# EasyEDA Pro project raspberry_esp.eprj

# Schematic schematic

## Sheets
1 interface_p0: Board Name: Board1; Create Date: 2025-11-21; Page Name: interface_p0; Project Name: raspberry_esp; Schematic Name: schematic; Update Date: 2025-12-31; Company: 嘉立创EDA; Page Size: A4; Version: V1.0
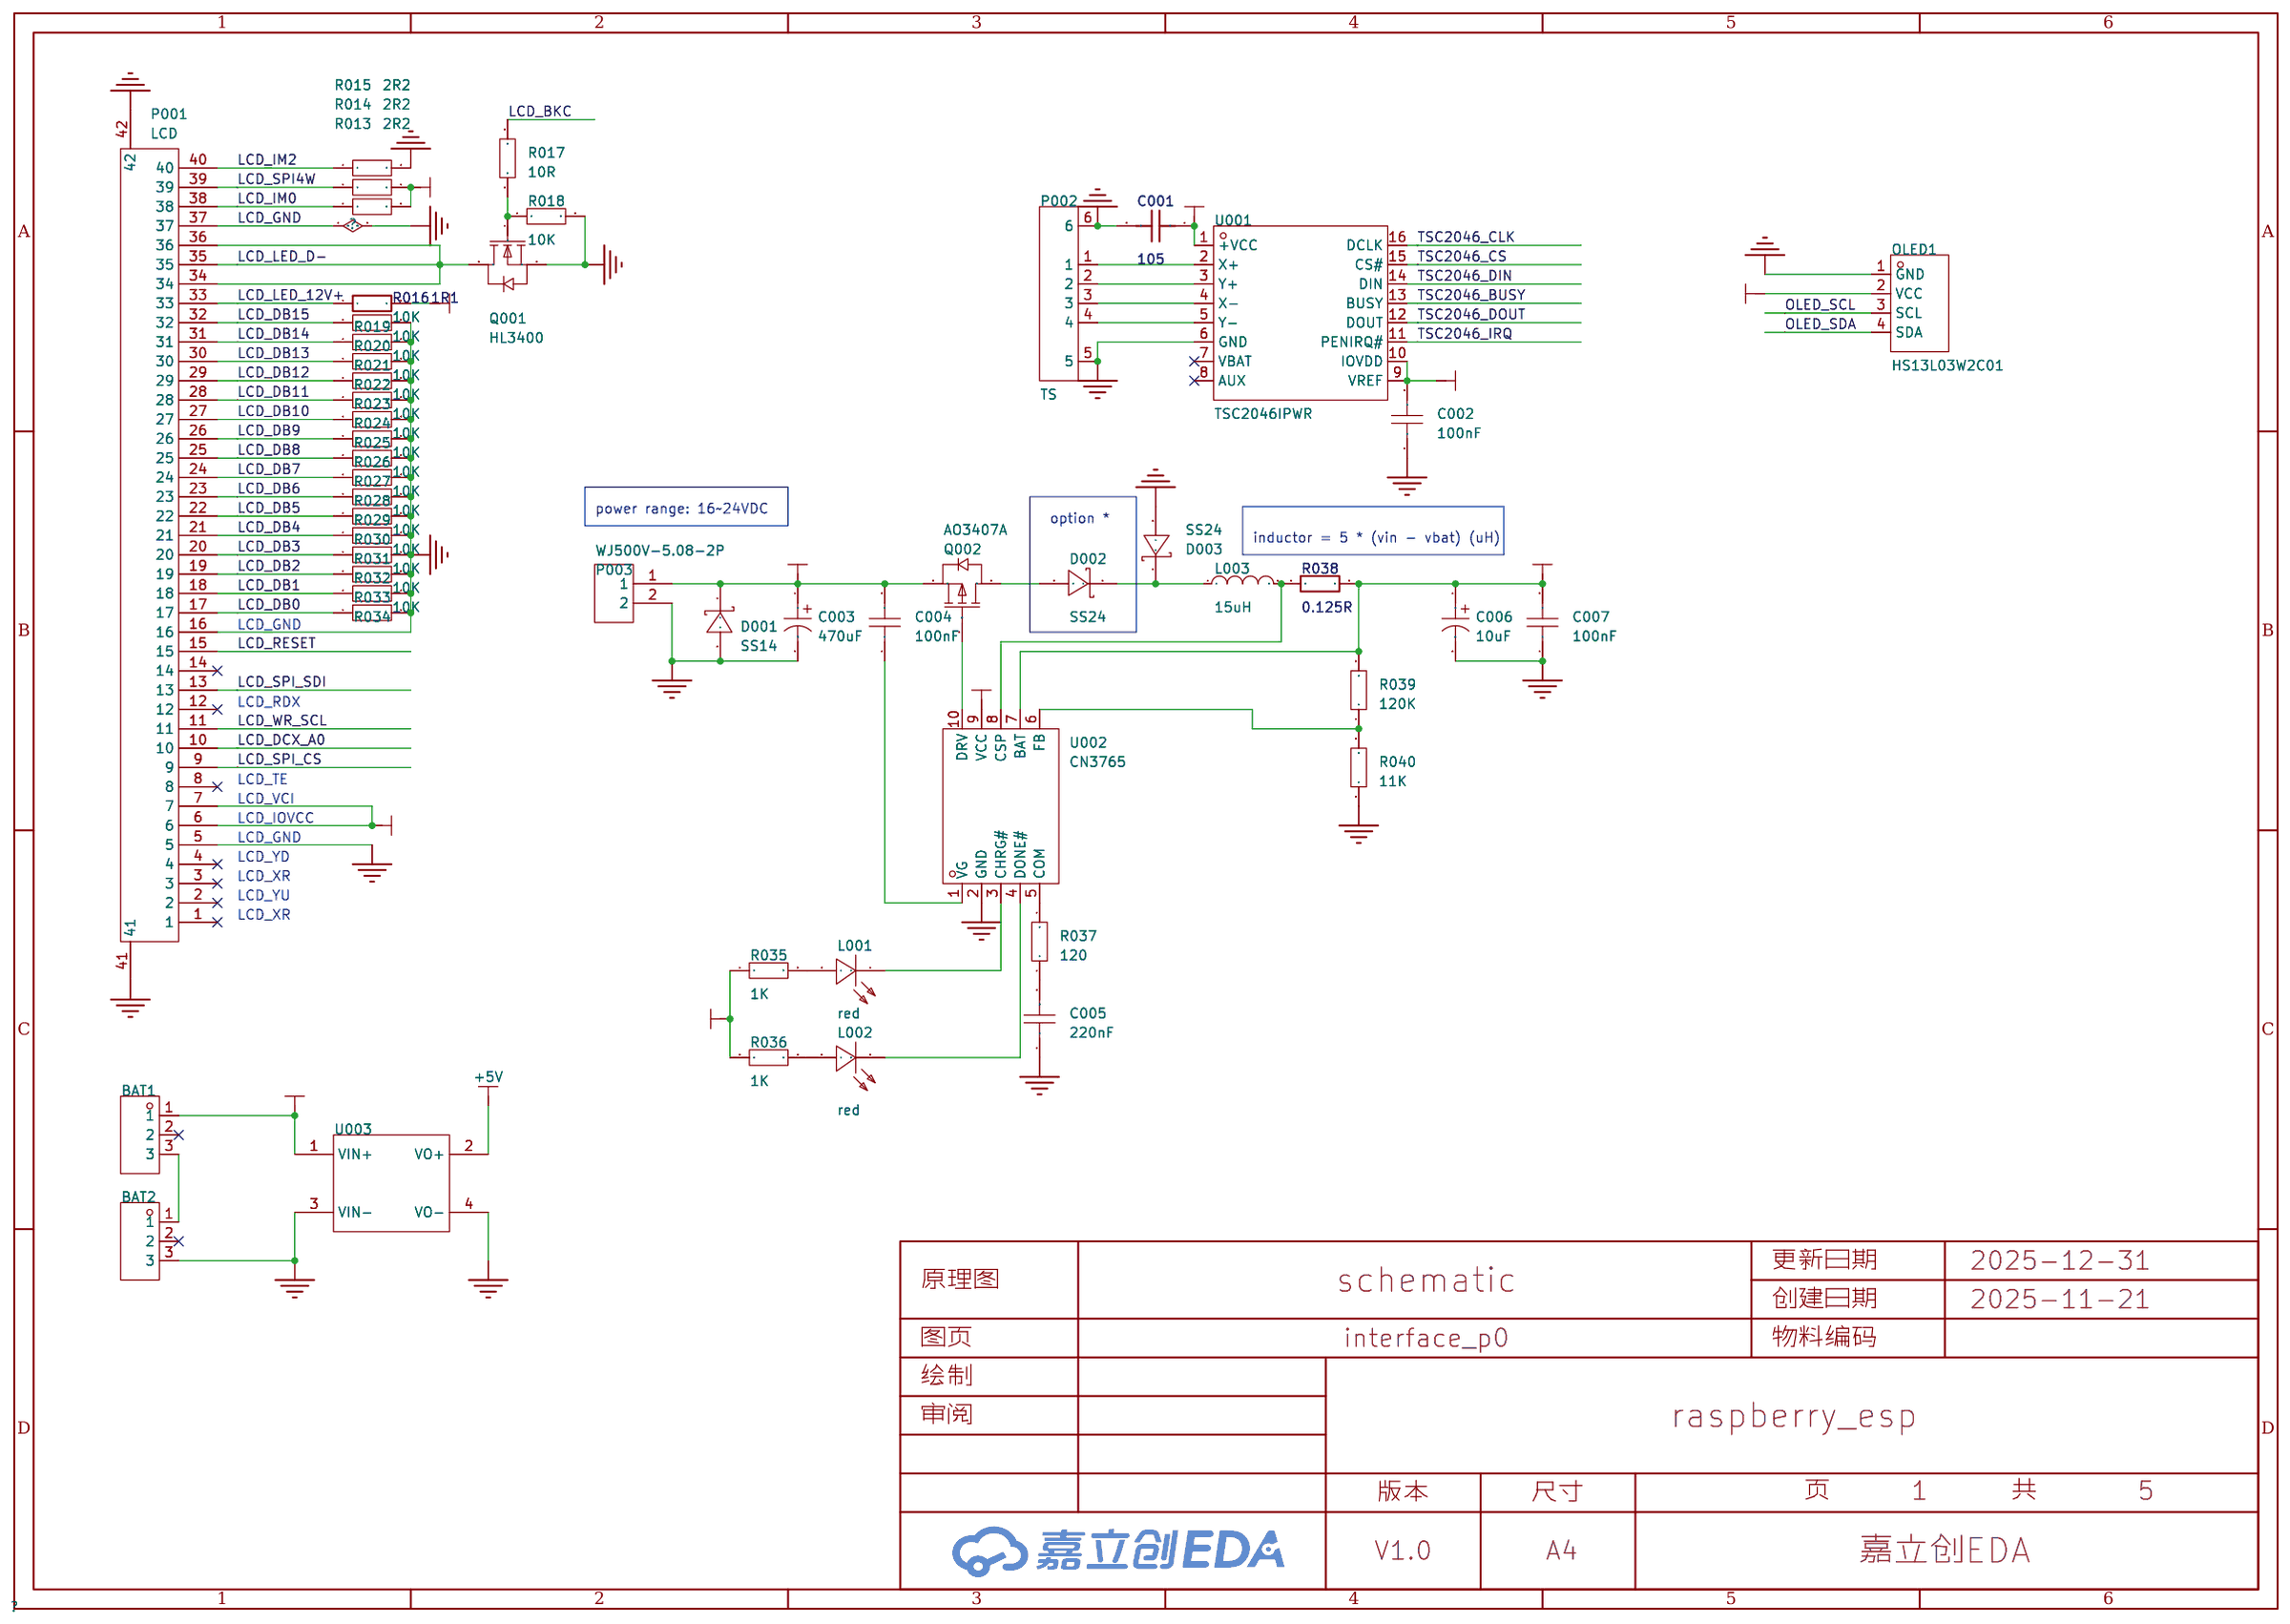
[diagram p0: interface_p0]
2 raspberry_p1: Create Date: 2025-12-24; Page Name: raspberry_p1; Update Date: 2026-01-07
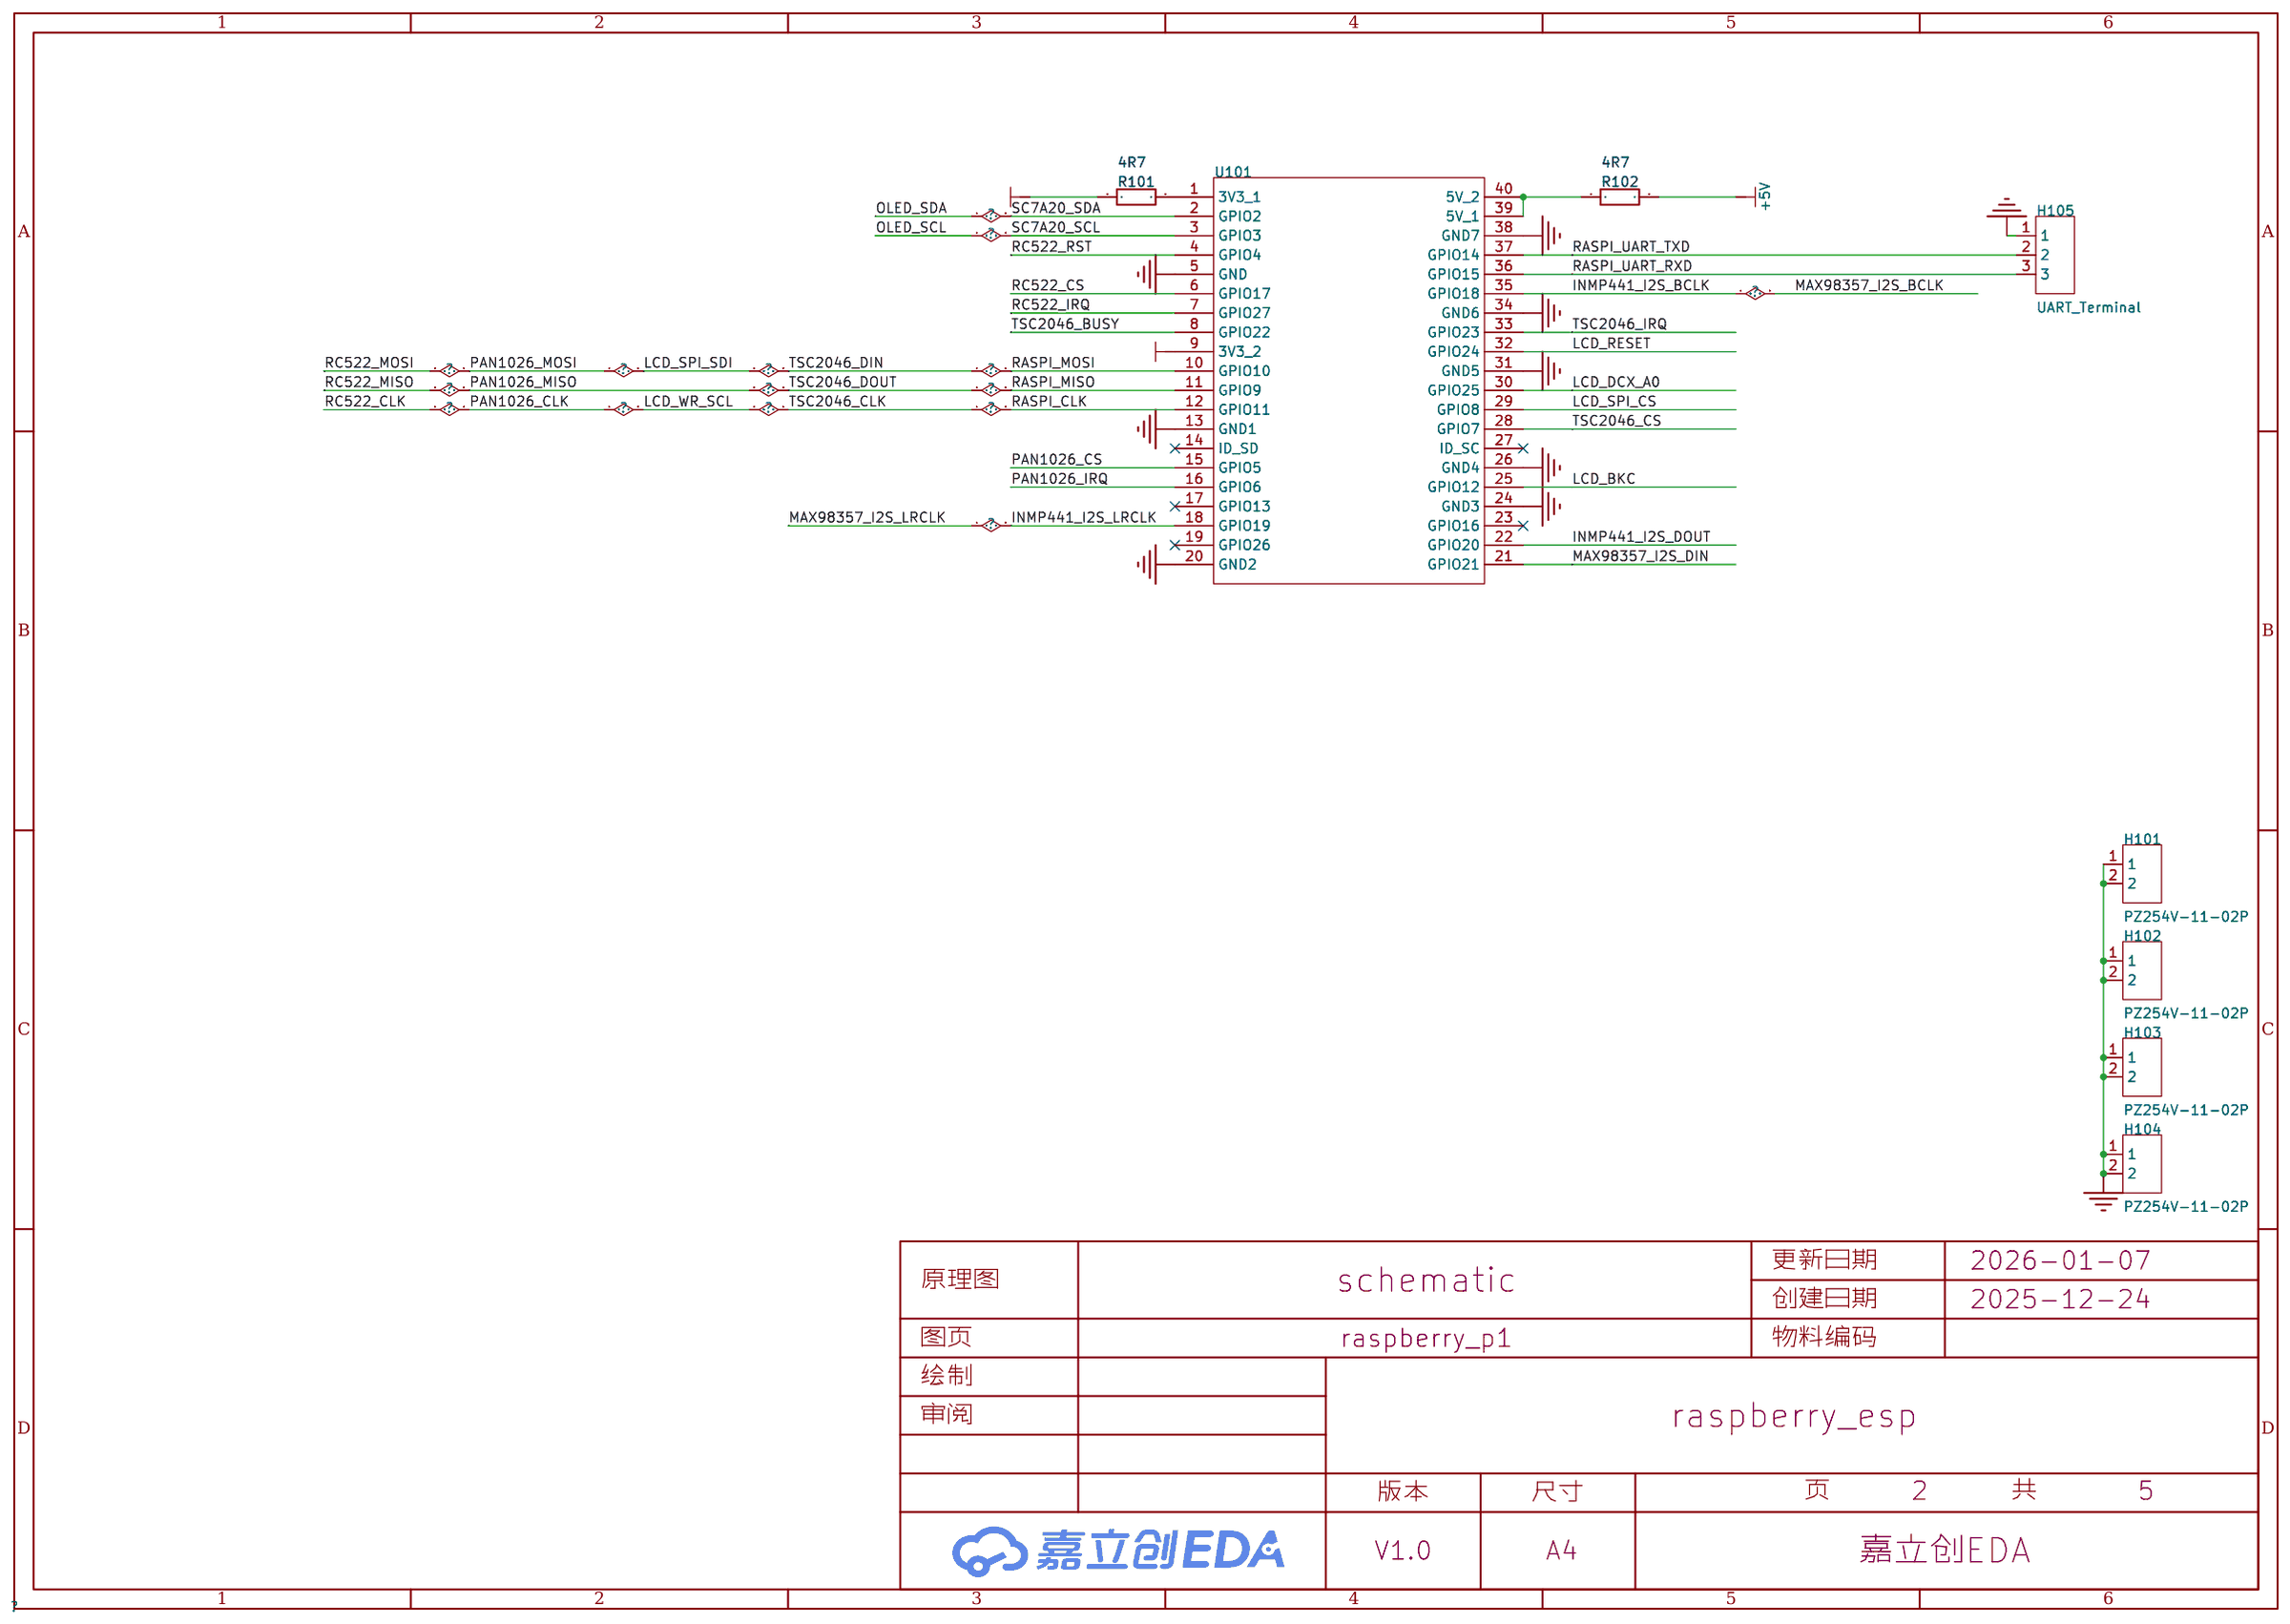
[diagram p1: raspberry_p1]
3 esp32_s3_p2: Create Date: 2025-12-25; Page Name: esp32_s3_p2; Update Date: 2026-01-07
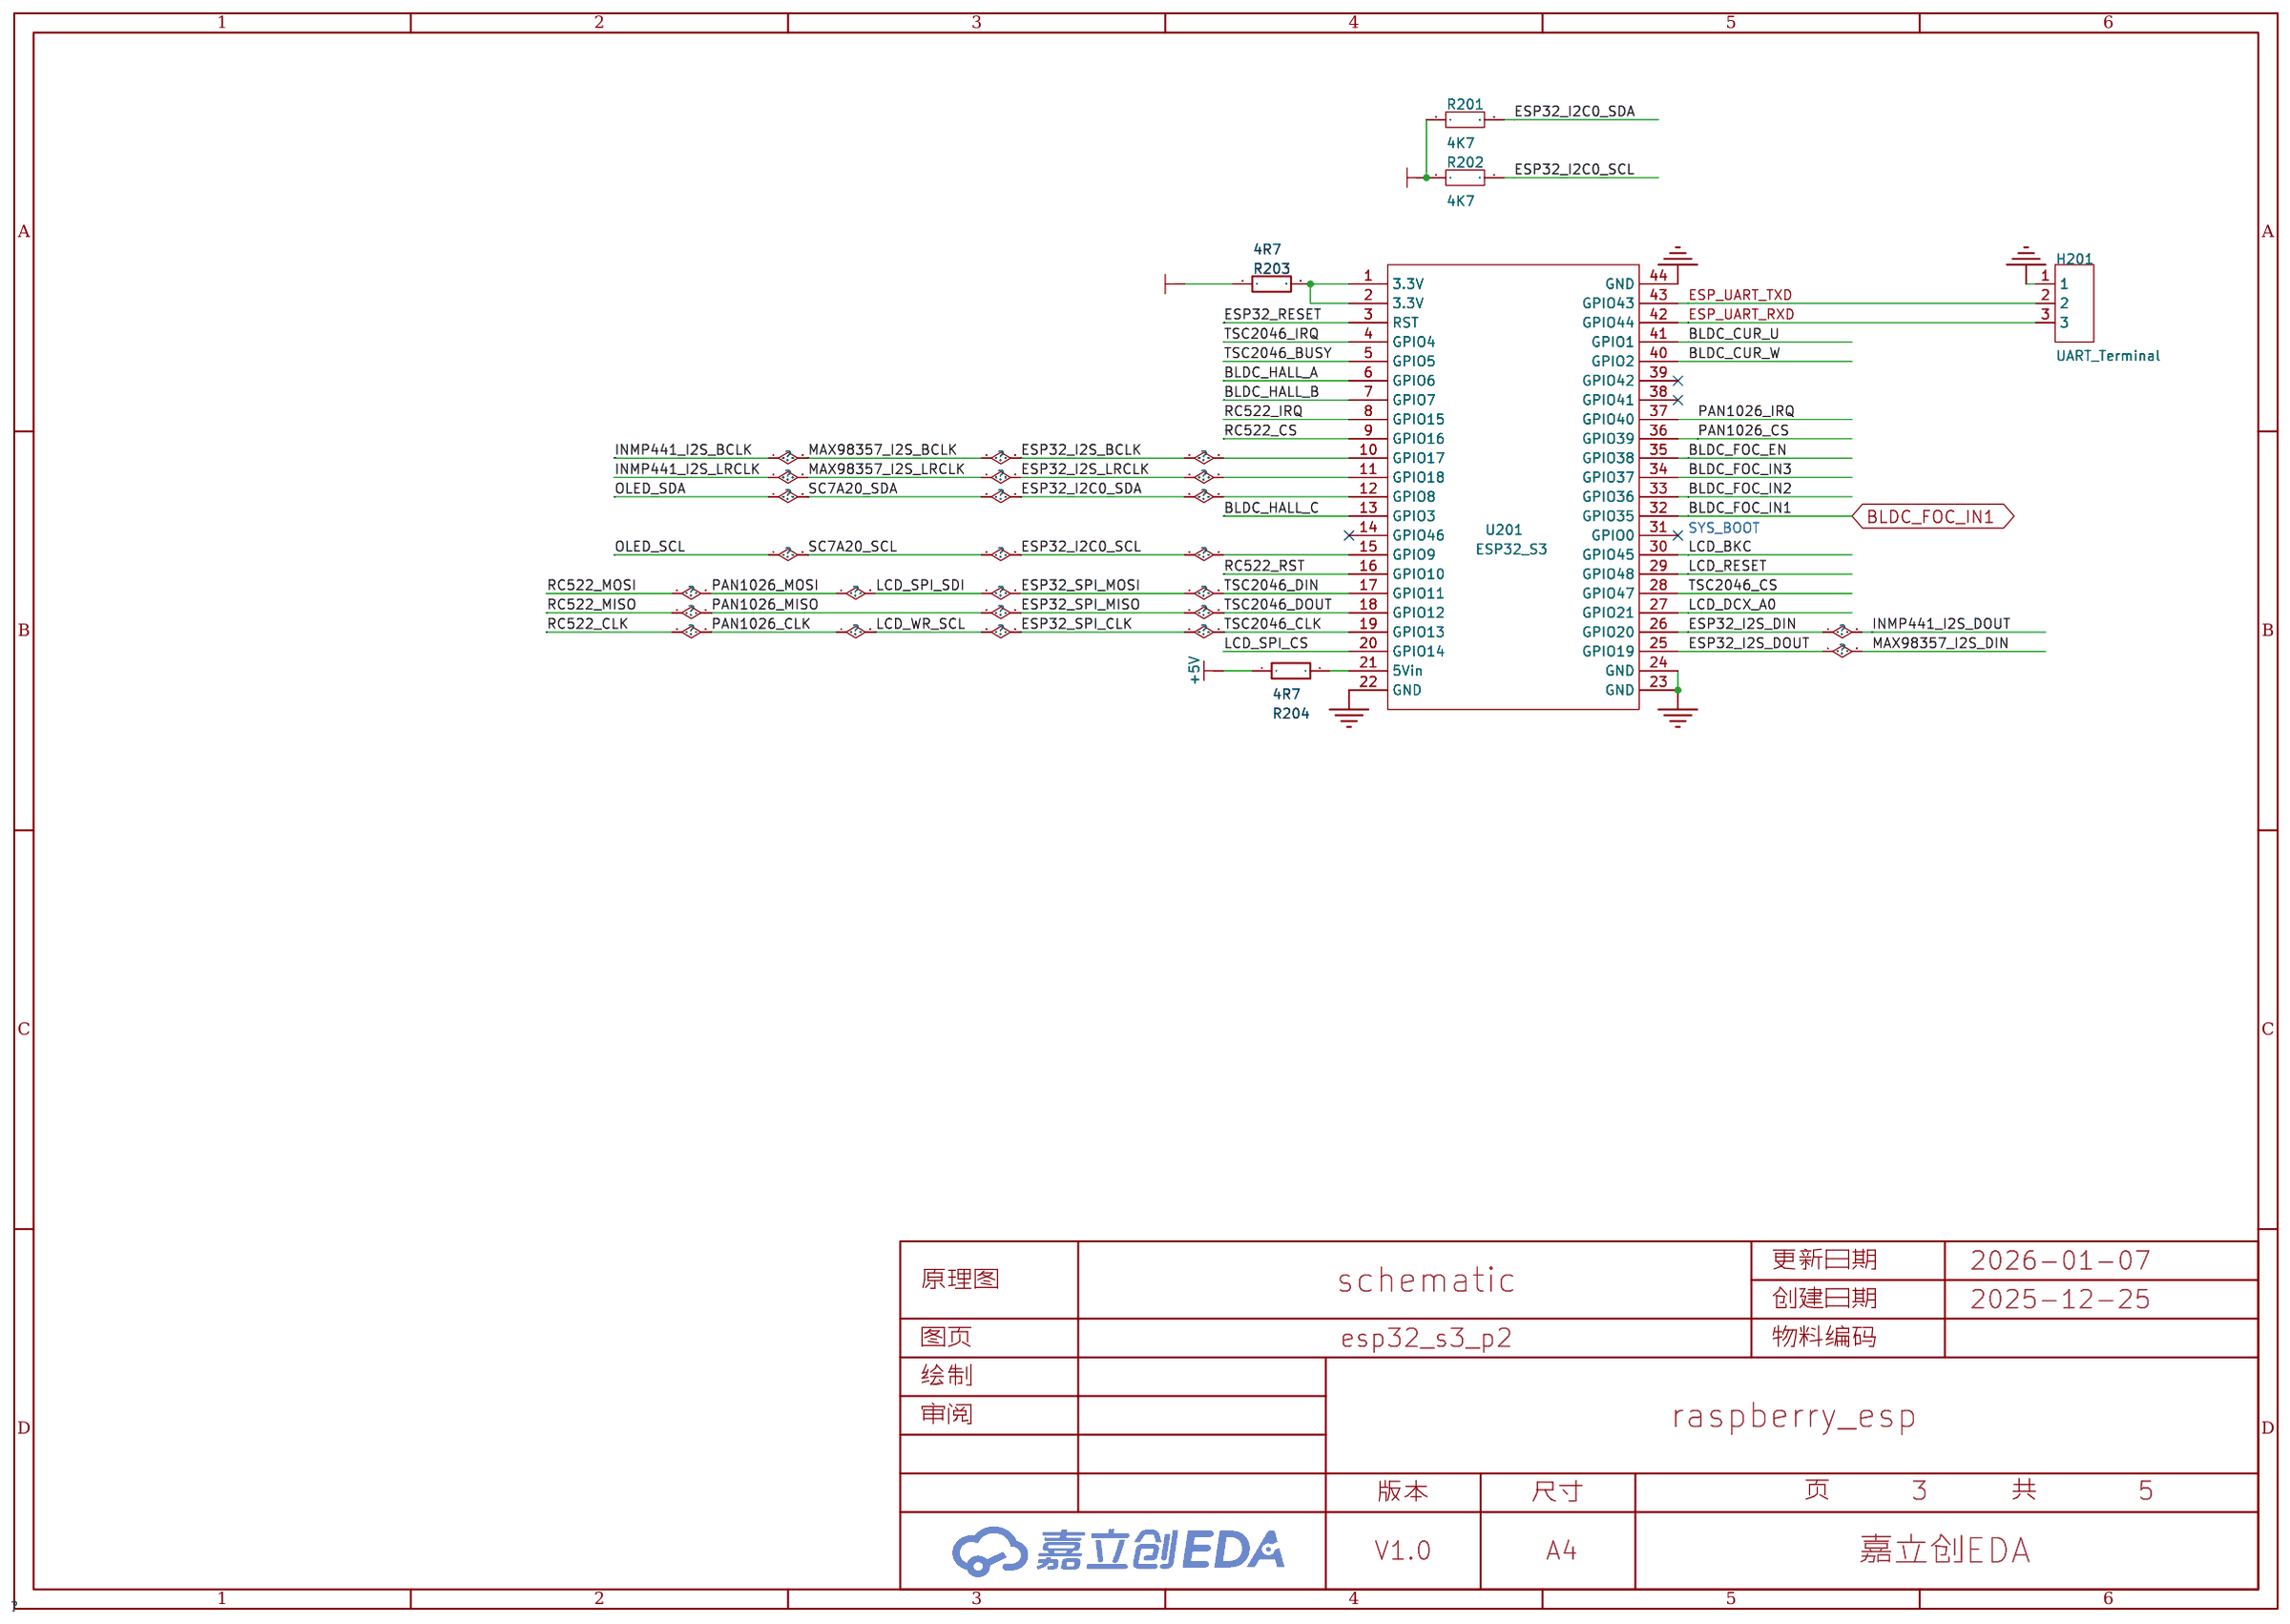
[diagram p2: esp32_s3_p2]
4 sensor_p3: Create Date: 2025-12-29; Page Name: sensor_p3; Update Date: 2026-01-07
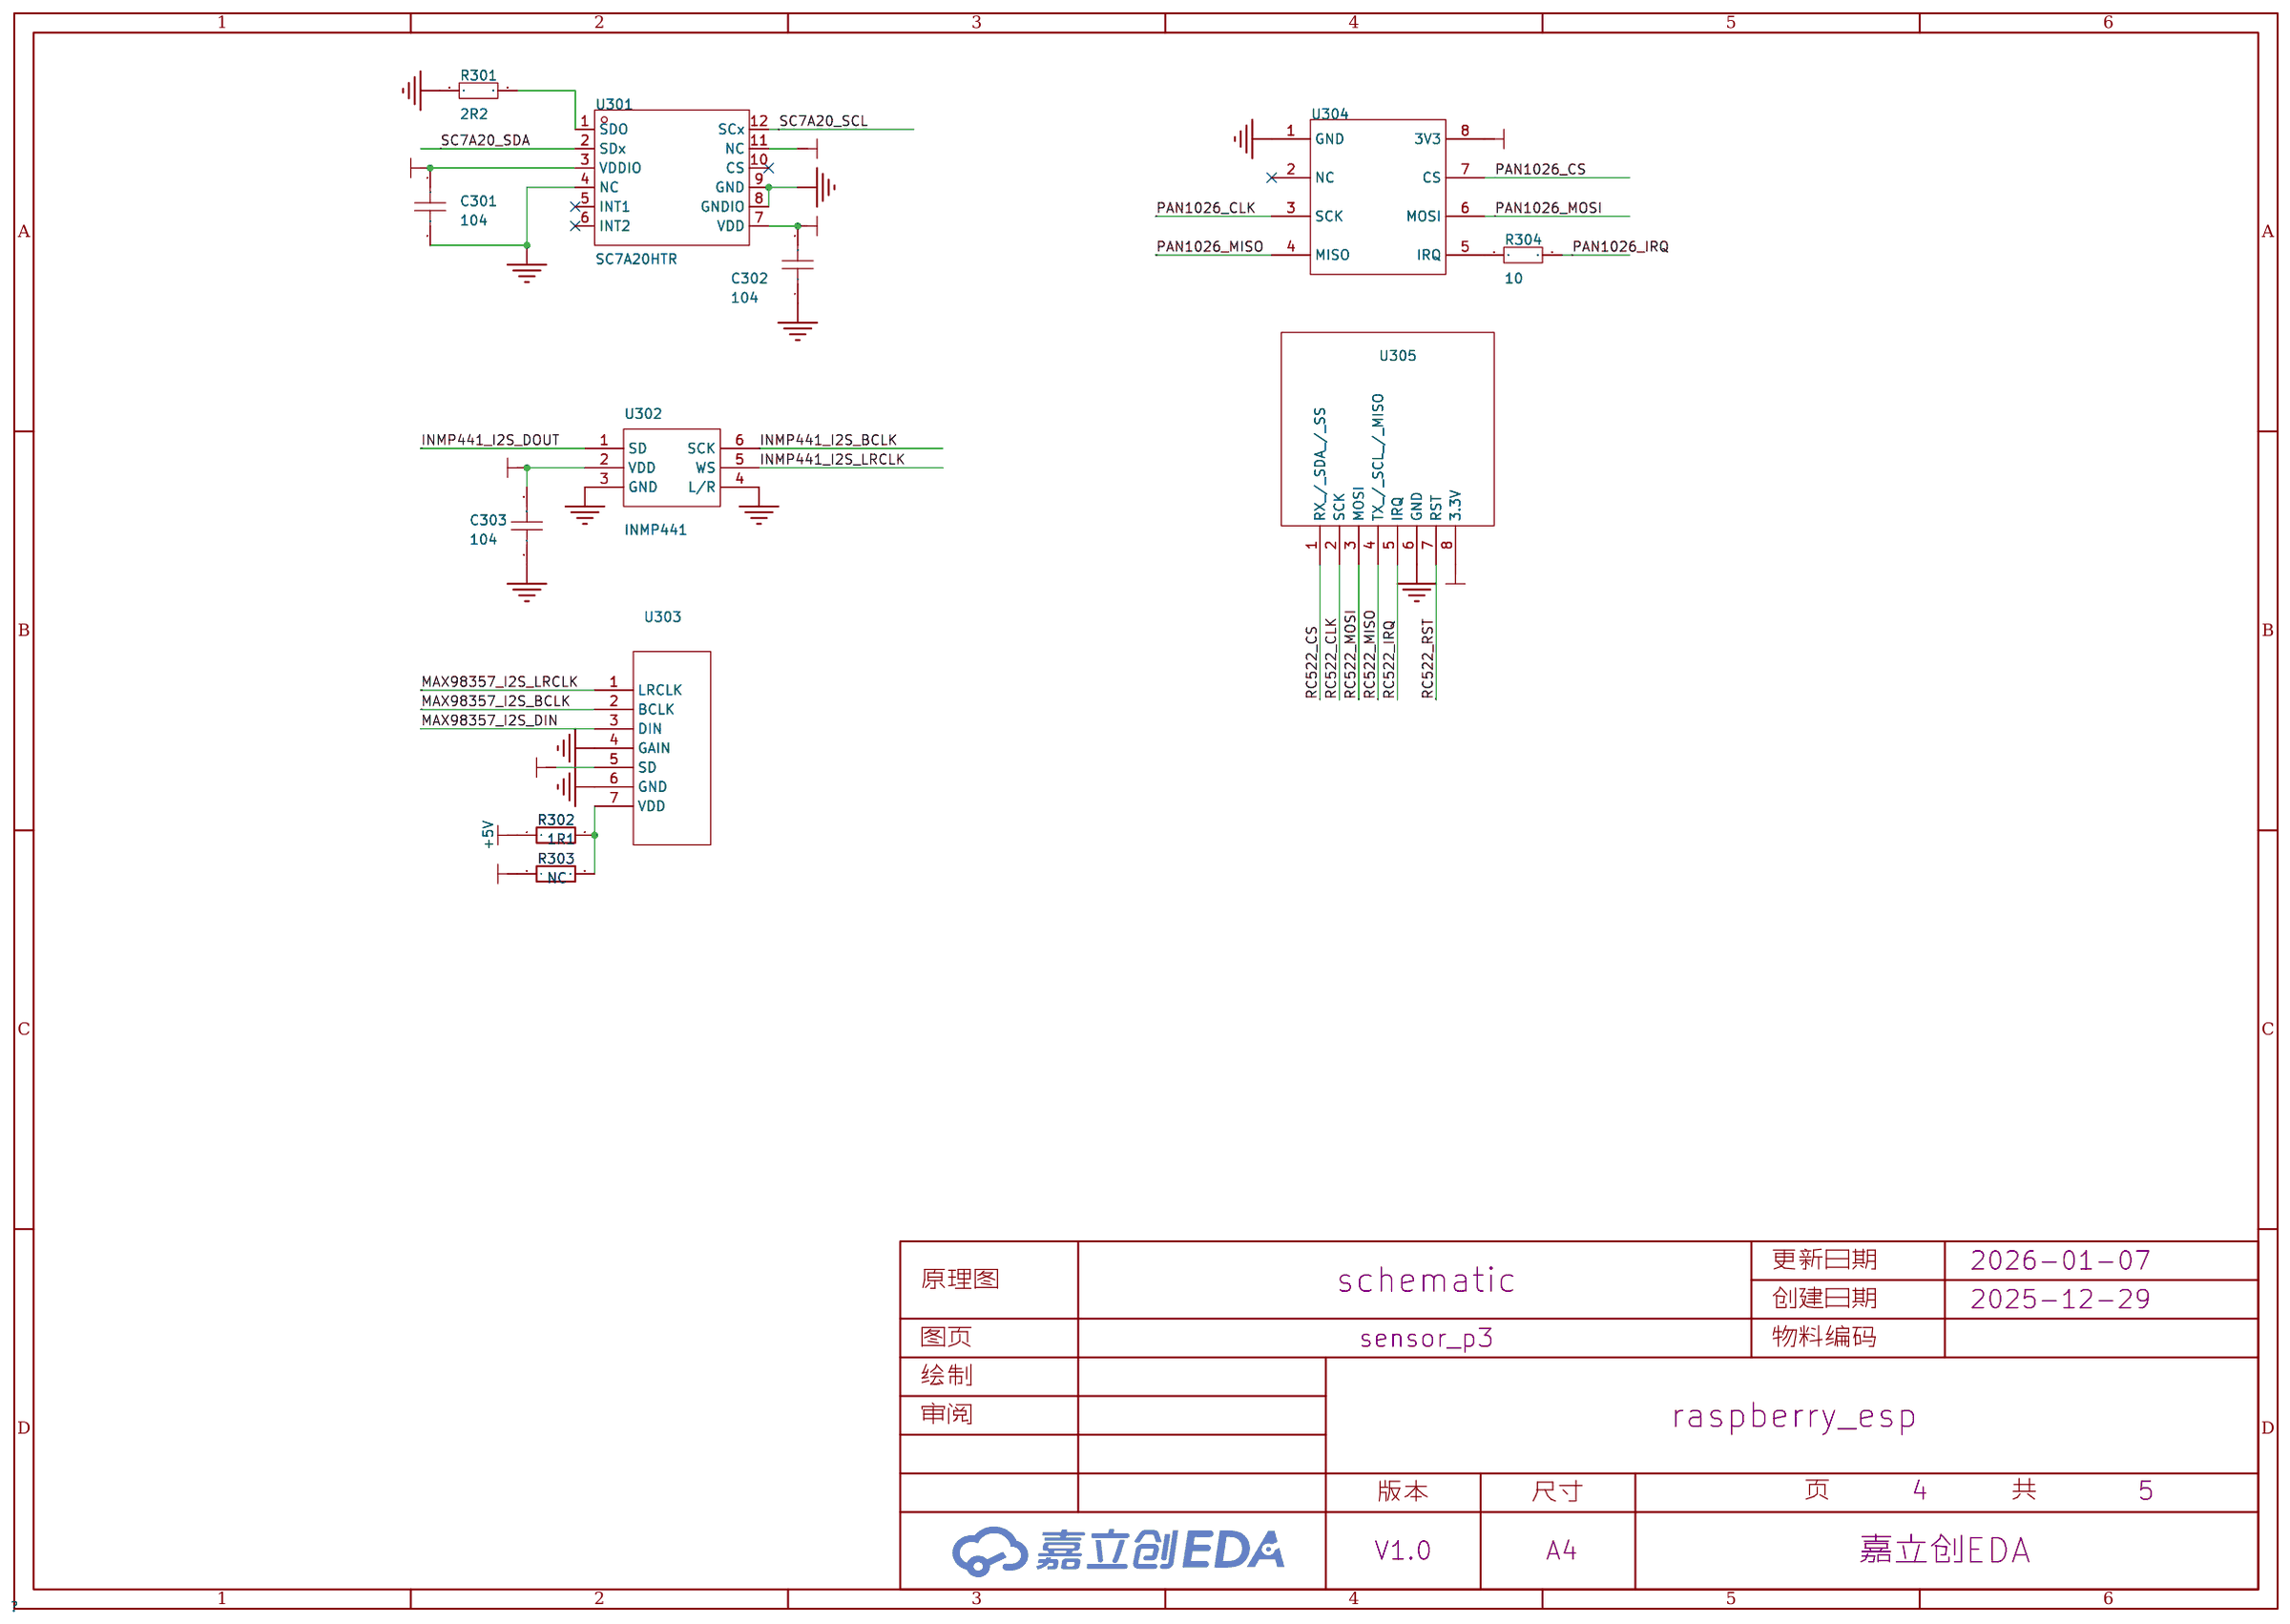
[diagram p3: sensor_p3]
5 brushless_motor: Create Date: 2025-12-30; Page Name: brushless_motor
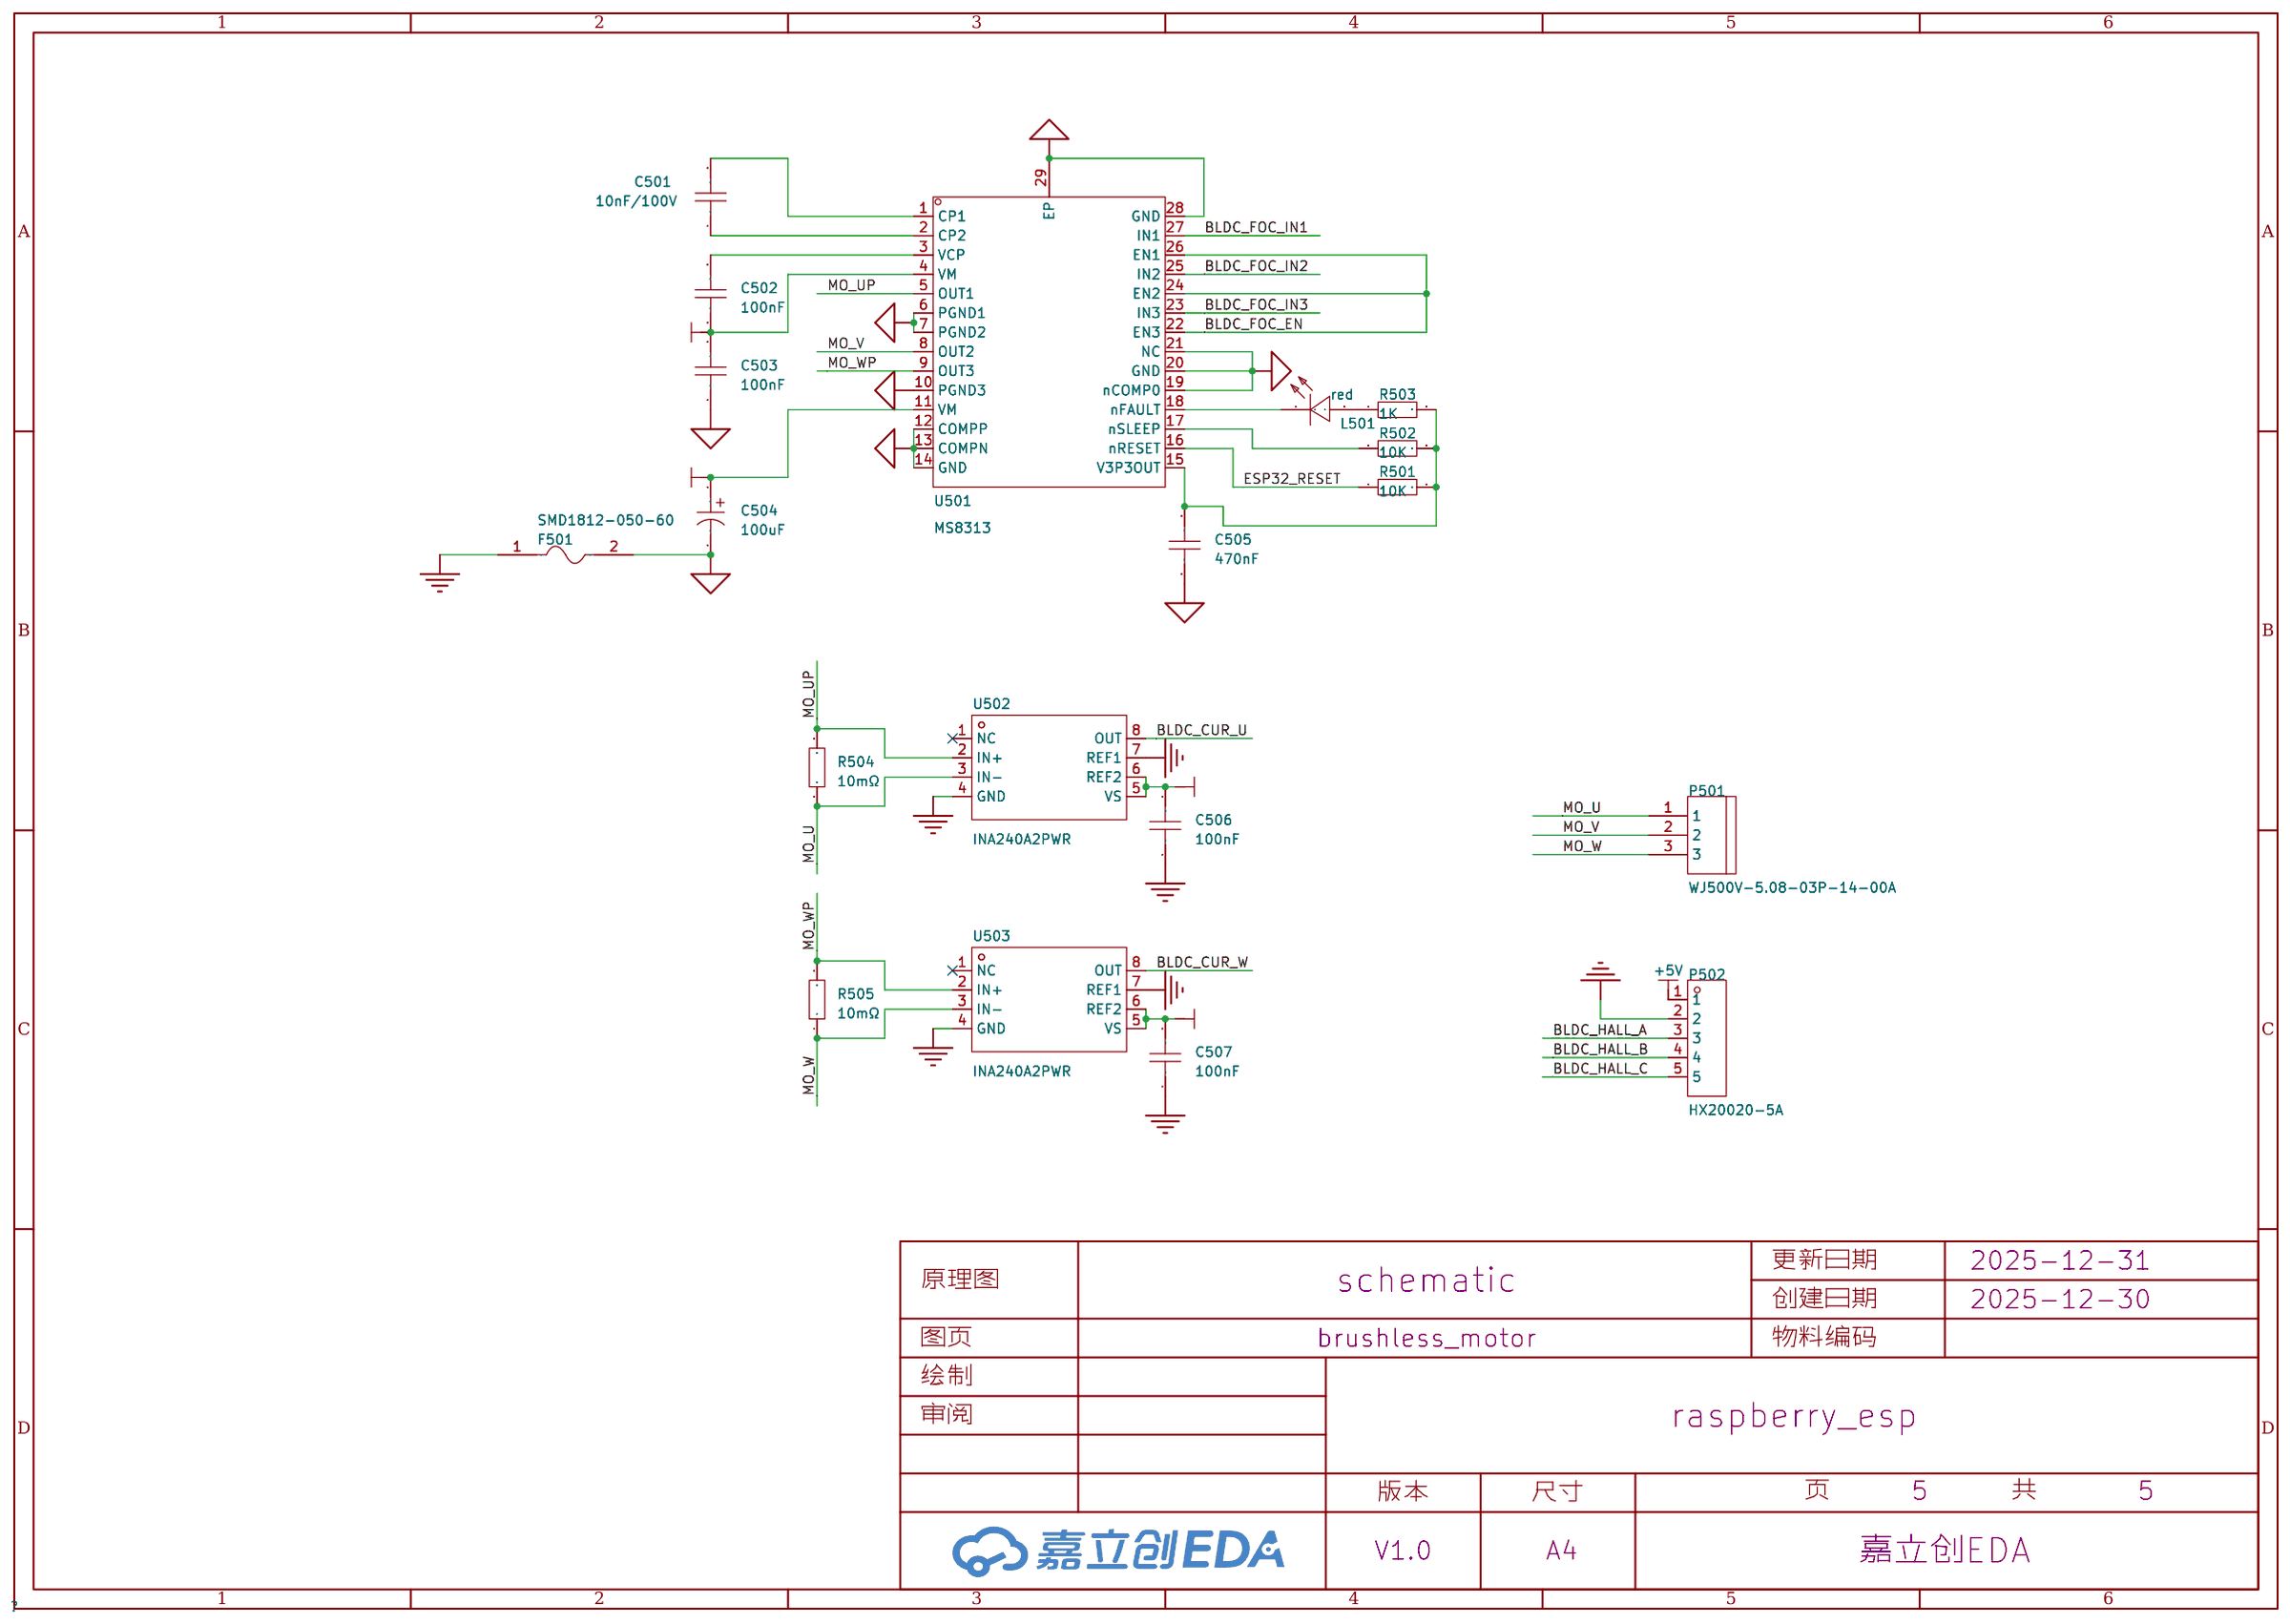
[diagram p4: brushless_motor]

## Parts
sheet brushless_motor
C501  10nF/100V  [C0603]
C502  100nF  [C0603]
C503  100nF  [C0603]
C504  100uF  [CAP-SMD_BD6.3-L6.6-W6.6-LS7.3-FD-H7.7]
C505  470nF  [C0603]
C506  100nF  [C0603]
C507  100nF  [C0603]
F501  SMD1812-050-60  [F1812]
L501  red  [LED0603-RD]
P501  WJ500V-5.08-03P-14-00A  [CONN-TH_3P-P5.00_WJ500V-5.08-3P]
P502  HX20020-5A  [CONN-TH_5P-P2.00_HX20020-5A]
R501  10K  [R0603]
R502  10K  [R0603]
R503  1K  [R0603]
R504  10mΩ  [R2010]
R505  10mΩ  [R2010]
U501  MS8313  [HTSSOP-28_L9.7-W4.4-P0.65-LS6.4-BL-EP]
U502  INA240A2PWR  [TSSOP-8_L4.4-W3.0-P0.65-LS6.4-BL]
U503  INA240A2PWR  [TSSOP-8_L4.4-W3.0-P0.65-LS6.4-BL]
sheet esp32_s3_p2
H201  UART_Terminal  [HDR-TH_3P-P2.54-V-M_PZ254V-11-03P]
R201  4K7  [R0603]
R202  4K7  [R0603]
R203  4R7  [R0805]
R204  4R7  [R0805]
U201  ESP32_S3  [ESP32_S3_N16R8]
sheet interface_p0
BAT1  ZX-XH2.54-3PZZ  [Bat_Lithium_6V4]
BAT2  ZX-XH2.54-3PZZ  [Bat_Lithium_6V4]
C001  105  [C0805]
C002  100nF  [C0603]
C003  470uF  [CAP-TH_BD8.0-P3.50-D0.6-FD_1]
C004  100nF  [C0603]
C005  220nF  [C0603]
C006  10uF  [CAP-TH_BD8.0-P3.50-D0.6-FD_1]
C007  100nF  [C0603]
D001  SS14  [SMA_L4.3-W2.6-LS5.2-RD]
D002  SS24  [SMA_L4.3-W2.6-LS5.2-RD]
D003  SS24  [SMA_L4.3-W2.6-LS5.2-RD]
L001  red  [LED0603-RD]
L002  red  [LED0603-RD]
L003  15uH  [IND-SMD_L7.1-W6.6]
OLED1  HS13L03W2C01  [OLED-TH_L35.4-W33.5_HS13L03W2C01]
P001  LCD  [FPC-SMD_AFC01-S40FCA-00]
P002  TS  [FPC-SMD_4P-P1.00_AFA07-S04ECA-00]
P003  WJ500V-5.08-2P  [CONN-TH_2P-P5.00_WJ500V-5.08-2P]
Q001  HL3400  [SOT-23-3_L2.9-W1.3-P1.90-LS2.4-BR]
Q002  AO3407A  [SOT-23-3_L2.9-W1.6-P1.90-LS2.8-BR]
R013  10K  [R0603]
R014  10K  [R0603]
R015  10K  [R0603]
R016  1R1  [R0805]
R017  10K  [R0603]
R018  10K  [R0603]
R019  10K  [R0603]
R020  10K  [R0603]
R021  10K  [R0603]
R022  10K  [R0603]
R023  10K  [R0603]
R024  10K  [R0603]
R025  10K  [R0603]
R026  10K  [R0603]
R027  10K  [R0603]
R028  10K  [R0603]
R029  10K  [R0603]
R030  10K  [R0603]
R031  10K  [R0603]
R032  10K  [R0603]
R033  10K  [R0603]
R034  10K  [R0603]
R035  10K  [R0603]
R036  10K  [R0603]
R037  10K  [R0603]
R038  0.125R  [R1206]
R039  10K  [R0603]
R040  10K  [R0603]
U001  TSC2046IPWR  [TSSOP-16_L5.0-W4.4-P0.65-LS6.4-BL]
U002  CN3765  [SSOP-10_L4.9-W3.9-P1.00-LS6.0-BL]
U003  -  [CX8823_MO]
sheet raspberry_p1
H101  PZ254V-11-02P  [HDR-TH_2P-P2.54-V-M]
H102  PZ254V-11-02P  [HDR-TH_2P-P2.54-V-M]
H103  PZ254V-11-02P  [HDR-TH_2P-P2.54-V-M]
H104  PZ254V-11-02P  [HDR-TH_2P-P2.54-V-M]
H105  UART_Terminal  [HDR-TH_3P-P2.54-V-M_PZ254V-11-03P]
R101  4R7  [R0805]
R102  4R7  [R0805]
U101  -  [finger_2x20_2.54]
sheet sensor_p3
C301  104  [C0603]
C302  104  [C0603]
C303  104  [C0603]
R301  10K  [R0603]
R302  1R1  [R0805]
R303  NC  [R0805]
R304  10  [R0603]
U301  SC7A20HTR  [LGA-12_L2.0-W2.0-P0.50-TL]
U302  INMP441  [INMP441_MODULE]
U303  -  [MAX98357_MODULE]
U304  -  [PAN1026]
U305  -  [RFID_RC522]

## Library data of the parts
C002 C004 C005 C007 C301-C303 C501-C503 C505-C507 = CGA0603X7R104K500JT: LCSC Part Name: 100nF ±10% 50V; Supplier Part: C6119867; Manufacturer: HRE(芯声); Supplier Footprint: 0603; JLCPCB Part Class: 扩展库; Datasheet: https://item.szlcsc.com/datasheet/CGA0603X7R104K500JT/7062573.html; Supplier: LCSC; Tolerance: ±10%; Voltage Rating: 50V; Temperature Coefficient: X7R
C504 = JVJ50V100M6x8: LCSC Part Name: 100uF ±20% 50V; Supplier Part: C46550415; Manufacturer: JIERR(捷而瑞); Supplier Footprint: SMD,D6.3xL7.7mm; JLCPCB Part Class: 扩展库; Datasheet: https://item.szlcsc.com/datasheet/JVJ50V100M6x8/48680109.html; Supplier: LCSC; Tolerance: ±20%; Voltage Rating: 50V; Ripple Current: 140mA@120Hz; Diameter: 6.3mm; Height - Seated (Max): 7.7mm; Lifetime: 2000hrs@105℃; Operating Temperature: -55℃~+105℃
F501 = SMD1812-050-60: Supplier Part: C46641148; Manufacturer: R+O(宏嘉诚); Supplier Footprint: 1812; JLCPCB Part Class: 扩展库; Datasheet: https://item.szlcsc.com/datasheet/SMD1812-050-60/48798754.html; Supplier: LCSC; Voltage - Max: 60V; Current - Max: 40A; Hold Current: 500mA; Trip Current: 1A; Power Dissipation: 1W; Resistance - Initial (Ri) (Min): 150mΩ; Resistance - Post Trip (R1) (Max): 1.4Ω; Time to Trip(Max): 150ms; Operating Temperature: -40℃~+85℃; Length: 4.73mm; Width: 3.41mm; Height: 1.5mm
L001 L002 L501 = NCD0603Y2: Supplier Part: C89811; Manufacturer: 国星光电; Supplier Footprint: 0603; JLCPCB Part Class: 扩展库; Datasheet: https://atta.szlcsc.com/upload/public/pdf/source/20200820/C89811_7FE84B429B6BCA3E113B125EE1452576.pdf; Supplier: LCSC; Emitted Color: 黄色; Forward Voltage (VF): 1.6V~2.6V; Power Dissipation: 65mW; Forward Current: 20mA; Dominant Wavelength: 586nm~595nm; Lens Color: 无色透明透镜; Luminous Intensity: 100mcd~220mcd; Viewing Angle: 130°; Operating Temperature: -30℃~+85℃
P501 = WJ500V-5.08-03P-14-00A: LCSC Part Name: 5.08mm 1x3P 排数:1 每排P数:3 直插; Supplier Part: C72334; Manufacturer: KANGNEX(康奈克斯电气); Supplier Footprint: 插件,P=5.08mm; JLCPCB Part Class: 扩展库; Datasheet: https://item.szlcsc.com/datasheet/WJ500V-5.08-03P-14-00A/73443.html; Supplier: LCSC; Number of Positions or Pins: 1x3P; Pitch: 5.08mm; Color: 绿色; Mounting Type: 直插; Number of Pins: 3P; Number of Rows: 1; Number of PINs Per Row: 3; Current Rating: 18A; Voltage Rating (Max): 250V; Wire Gauge - AWG: 14~30; Wire Gauge - mm2: 2.5; Operating Temperature: -40℃~+105℃
P502 = HX20020-5A: LCSC Part Name: 母座 直插/直针 2.0mm 5Pin位 母座; Supplier Part: C442247; Manufacturer: HX(红星); Supplier Footprint: 插件,P=2mm; JLCPCB Part Class: Extended Part; Datasheet: https://atta.szlcsc.com/upload/public/pdf/source/20191028/C442247_BDD205EF09F39416709037AE8A11E196.pdf; Supplier: LCSC; Pitch: 2mm; Pins Structure: 1x5P; Number of Rows: 1; Number of PINs Per Row: 5; Gender: 公型插针; Mounting Style: 直插
R013 R014 R015 R017 R018 R019 R020 R021 R022 R023 R024 R025 R026 R027 R028 R029 R030 R031 R032 R033 R034 R035 R036 R037 R039 R040 R201 R202 R301 R304 R501-R503 = Res_0603: Supplier Footprint: 0603
R504 R505 = 201007F100MT4E: LCSC Part Name: 10mΩ ±1% 750mW 厚膜电阻; Supplier Part: C473638; Manufacturer: UNI-ROYAL(厚声); Supplier Footprint: 2010; JLCPCB Part Class: 扩展库; Datasheet: https://item.szlcsc.com/datasheet/201007F100MT4E/480031.html; Supplier: LCSC; Type: 厚膜电阻; Tolerance: ±1%; Power(Watts): 750mW; Voltage-Supply(Max): 200V; Temperature Coefficient: ±1500ppm/℃; Operating Temperature: -55℃~+155℃
U501 = MS8313: LCSC Part Name: 2.5A 36V电机驱动芯片; Supplier Part: C231942; Manufacturer: 杭州瑞盟; Supplier Footprint: HTSSOP-28-EP; JLCPCB Part Class: 扩展库; Datasheet: https://item.szlcsc.com/datasheet/MS8313/231840.html; Supplier: LCSC; Drive Type: 三相; Number of Half Bridges: 3; Output Current: 1.75A; Peak Current: 2.5A; RDS(on): 240mΩ; Operating Temperature: -40℃~+150℃
U502 U503 = INA240A2PWR: Supplier Part: C129949; Manufacturer: TI(德州仪器); Supplier Footprint: TSSOP-8; JLCPCB Part Class: 扩展库; Datasheet: https://www.ti.com/cn/lit/gpn/ina240; Supplier: LCSC; Number of Channels: 单路; Supply Current: 1.8mA; Operating Temperature: -40℃~+125℃
H105 H201 = PZ254V-11-03P: LCSC Part Name: 1x3P 间距:2.54mm 方针 直插; Supplier Part: C2937625; Manufacturer: XFCN(兴飞); Supplier Footprint: 插件,P=2.54mm; JLCPCB Part Class: 扩展库; Datasheet: https://item.szlcsc.com/datasheet/PZ254V-11-03P/3293280.html; Supplier: LCSC; Pin Structure: 1x3P; Pitch: 2.54mm; Circluar Pins/Square Pins: 方针; Mounting Type: 直插; Number of Rows: 单排; Number of Pins: 3P; Current Rating: 3A; Voltage Rating (Max): 250V; Length of Mating Pin: 6mm; Insulation Height: 2.5mm; Length of End Connection Pin: 3mm; Operating Temperature: -40℃~+105℃; Color: 黑色
R016 R038 R101 R102 R203 R204 R302 R303 = 0805W8F1002T5E_C17414: LCSC Part Name: 10kΩ ±1% 125mW 厚膜电阻; Supplier Part: C17414; Manufacturer: UNI-ROYAL(厚声); Manufacturer Part: 0805W8F1002T5E; Supplier Footprint: 0805; JLCPCB Part Class: Basic Part; Datasheet: https://atta.szlcsc.com/upload/public/pdf/source/20200306/C422600_1E6D84923E4A46A82E41ADD87F860B5C.pdf; Supplier: LCSC; Type: 厚膜电阻; Tolerance: ±1%; Power(Watts): 125mW; Overload Voltage (Max): 150V; Temperature Coefficient: ±100ppm/℃; Operating Temperature Range: -55℃~+155℃
U201 = ESP32_S3_N16R8
BAT1 BAT2 = ZX-XH2.54-3PZZ: LCSC Part Name: 1x3P 间距:2.5mm 直插 系列:XH; Supplier Part: C7429633; Manufacturer: Megastar(兆星); Supplier Footprint: 插件,P=2.5mm; JLCPCB Part Class: 扩展库; Datasheet: https://item.szlcsc.com/datasheet/ZX-XH2.54-3PZZ/8427550.html; Supplier: LCSC; Pins Structure: 1x3P; Pitch: 2.5mm; Mounting Type: 直插; Reference Series: XH; Number of Pins: 3P; Number of Rows: 1; Number of PINs Per Row: 3; Current Rating: 3A; Contact Material: 黄铜; Contact Plating: 锡; Operating Temperature: -25℃~+85℃; Voltage Rating: 250V; Plastic Material: PA66; Flame Retardant Rating: UL94V-0; Color: 白色; Z-Height of the Board: 7mm; X-Length of Bottom Edge on Board (Spacing Line): 10mm; Y-Width of Bottom Edge on Board: 5.9mm
C001 = CGA0805X5R106K250MT: LCSC Part Name: 10uF ±10% 25V; Supplier Part: C6119887; Manufacturer: HRE(芯声); Supplier Footprint: 0805; JLCPCB Part Class: Extended Part; Supplier: LCSC; Tolerance: ±10%; Voltage Rating: 25V; Temperature Coefficient: X5R
C003 C006 = CD2884771EM0812VFL: LCSC Part Name: 470uF ±20% 25V; Supplier Part: C2960233; Manufacturer: HRK(鸿瑞凯电子); Supplier Footprint: 插件,D8xL12mm; JLCPCB Part Class: 扩展库; Datasheet: https://item.szlcsc.com/datasheet/CD2884771EM0812VFL/3346945.html; Supplier: LCSC; Tolerance: ±20%; Voltage Rating: 25V; Ripple Current: 905mA@100kHz; Equivalent Series Resistance(ESR): 69mΩ@100kHz; Pin Spacing: 3.5mm; Diameter: 8mm; Height - Seated (Max): 12mm; Lifetime: 3000hrs@105℃; Operating Temperature: -40℃~+105℃
D001 D002 D003 = SS14_C83852: LCSC Part Name: 电压:40V 电流:1A; Supplier Part: C83852; Manufacturer: onsemi(安森美); Supplier Footprint: SMA(DO-214AC); JLCPCB Part Class: 扩展库; Datasheet: https://item.szlcsc.com/datasheet/SS14/85019.html; Supplier: LCSC; Voltage - Forward(Vf@If): 500mV@1A; Voltage - DC Reverse(Vr): 40V; Current - Rectified: 1A; Reverse Leakage Current (Ir): 200uA@40V; Operating Junction Temperature Range: -65℃~+125℃; Non-Repetitive Peak Forward Surge Current: 40A
L003 = SMMS0650-101M: LCSC Part Name: 100uH ±20% 2A; Supplier Part: C2894722; Manufacturer: SXN(顺翔诺); Supplier Footprint: SMD,6.6x7.1mm; JLCPCB Part Class: 扩展库; Datasheet: https://item.szlcsc.com/datasheet/SMMS0650-101M/3130469.html; Supplier: LCSC; Tolerance: ±20%; Current Rating: 1.5A; Current - Saturation(Isat): 2A; DC Resistance(DCR): 720mΩ
OLED1 = HS13L03W2C01: LCSC Part Name: 1.3'1.3寸 128*64 OLED显示屏 I2C通讯 SH1106 白光; Supplier Part: C7465997; Manufacturer: HS(汉昇); JLCPCB Part Class: 扩展库; Datasheet: https://atta.szlcsc.com/upload/public/pdf/source/20230720/8731A47396DED074CDCD72E9ACEFB46F.pdf; Supplier: LCSC; Main Control Chip: SH1106; Interface Type: I2C; Size: 1.3; Operating Temperature: -40℃~+70℃
P001 = AFC01-S40FCA-00: LCSC Part Name: 翻盖式 下接 P数:40P 间距:0.5mm; Supplier Part: C262674; Manufacturer: JS(钜硕电子); Supplier Footprint: SMD,P=0.5mm,卧贴; JLCPCB Part Class: 扩展库; Datasheet: https://item.szlcsc.com/datasheet/AFC01-S40FCA-00/253933.html; Supplier: LCSC; Locking Feature: 翻盖式; Contact Type: 下接; Number of Contacts: 40P; Pitch: 0.5mm; Mounting Type: 卧贴; FFC, FCB Thickness: 0.3mm; Height Above Board: 2mm; Contact Material: 铜合金; Contact Plating: 锡; Operating Temperature: -45℃~+85℃; Rated Voltage (Max): 50V; Current Rating (Max): 500mA
P002 = AFA07-S04ECA-00: LCSC Part Name: 间距:1mm P数:4P 抽屉式 上接; Supplier Part: C262731; Manufacturer: JS(钜硕电子); Supplier Footprint: SMD,P=1mm,卧贴; JLCPCB Part Class: 扩展库; Datasheet: https://item.szlcsc.com/datasheet/AFA07-S04ECA-00/253990.html; Supplier: LCSC; Locking Feature: 抽屉式; Contact Type: 上接; Number of Contacts: 4P; Pitch: 1mm; Mounting Type: 卧贴; FFC, FCB Thickness: 0.3mm; Height Above Board: 2.5mm
P003 = WJ500V-5.08-2P: LCSC Part Name: 1x2P 5.08mm 直插 排数:1 每排P数:2; Supplier Part: C8465; Manufacturer: KANGNEX(康奈克斯电气); Supplier Footprint: 插件,P=5.08mm; JLCPCB Part Class: 扩展库; Datasheet: https://atta.szlcsc.com/upload/public/pdf/source/20191225/C8465_02D34CE5B5B4A53DF5891601D97FA9F4.pdf; Supplier: LCSC; Structure: 1x2P; Pitch: 5.08mm; Color: 绿色; Mounting Style: 直插; Current Rating (Max): 18A; Voltage Rating (Max): 250V; Number of Pins: 2P; Number of Rows: 1; Wire Gauge - AWG: 14~30; Wire Gauge - mm2: 2.5; Number of PINs Per Row: 2; Operating Temperature Range: -40℃~+105℃; Screw Specification: M2.5
Q001 = HL3400: LCSC Part Name: N-通道,电流:5.6A,耐压:30V; Supplier Part: C22469448; Manufacturer: R+O(宏嘉诚); Supplier Footprint: SOT-23; JLCPCB Part Class: 扩展库; Datasheet: https://item.szlcsc.com/datasheet/HL3400/24180419.html; Supplier: LCSC; Number: 1个N沟道; Drain to Source Voltage: 30V; Current - Continuous Drain(Id): 5.6A; RDS(on): 21mΩ@10V；33mΩ@2.5V；25mΩ@4.5V; Pd - Power Dissipation: 1.2W; Gate Threshold Voltage (Vgs(th)): 900mV@250uA; Gate Charge(Qg): 17nC@10V; Input Capacitance(Ciss): 630pF; Reverse Transfer Capacitance (Crss@Vds): 71pF; Operating Temperature: -55℃~+150℃; Type: N沟道; Output Capacitance(Coss): 90pF
Q002 = AO3407A_C15155: LCSC Part Name: 1个P沟道 耐压:30V 电流:4.3A; Supplier Part: C15155; Manufacturer: AOS; Supplier Footprint: SOT-23; JLCPCB Part Class: 扩展库; Datasheet: https://item.szlcsc.com/datasheet/AO3407A/15829.html; Supplier: LCSC; Number: 1个P沟道; Drain to Source Voltage: 30V; Current - Continuous Drain(Id): 4.3A; RDS(on): 48mΩ@10V; Gate Threshold Voltage (Vgs(th)): 2.5V@250uA; Gate Charge(Qg): 16nC@10V; Input Capacitance(Ciss): 830pF; Reverse Transfer Capacitance (Crss@Vds): 92pF@15V
U001 = TSC2046IPWR: LCSC Part Name: TSC2046 触摸屏控制器; Supplier Part: C8954; Manufacturer: TI(德州仪器); Supplier Footprint: TSSOP-16; JLCPCB Part Class: 扩展库; Datasheet: https://www.ti.com/cn/lit/gpn/tsc2046; Supplier: LCSC; Touch Screen Type: 4 线电阻式; Resolution (Bits): 12位; Interface: QSPI；SPI; Voltage - Supply: 2V~5.25V; Throughput Rate: 125kHz; Operating Temperature: -40℃~+85℃
U002 = CN3765: LCSC Part Name: 4A多类型电池充电管理集成电路; Supplier Part: C162329; Manufacturer: CONSONANCE(上海如韵); Supplier Footprint: SSOP-10-150mil; JLCPCB Part Class: 扩展库; Datasheet: https://item.szlcsc.com/datasheet/CN3765/173710.html; Supplier: LCSC; Voltage - Supply: 6.6V~30V; Operating Temperature: -40℃~+85℃
U003 = CX8823_5V
H101-H104 = PZ254V-11-02P: LCSC Part Name: 1x2P 间距:2.54mm 方针 直插; Supplier Part: C492401; Manufacturer: XFCN(兴飞); Supplier Footprint: 插件,P=2.54mm; JLCPCB Part Class: 扩展库; Datasheet: https://item.szlcsc.com/datasheet/PZ254V-11-02P/502957.html; Supplier: LCSC; Pin Structure: 1x2P; Pitch: 2.54mm; Circluar Pins/Square Pins: 方针; Mounting Type: 直插; Number of Rows: 单排; Number of Pins: 2P; Length of Mating Pin: 6mm; Insulation Height: 2.5mm; Length of End Connection Pin: 3mm; Contact Material: 黄铜; Operating Temperature: -40℃~+105℃; Color: 黑色
U101 = raspberry-pi4
U301 = SC7A20HTR: Supplier Part: C19274408; Manufacturer: SILAN(士兰微); Supplier Footprint: LGA-12(2x2); JLCPCB Part Class: 扩展库; Datasheet: https://item.szlcsc.com/datasheet/SC7A20HTR/20603496.html; Supplier: LCSC
U302 = INMP441_module
U303 = MAX98357A_MODULE
U304 = PAN1026
U305 = RFID_RC522

## Nets
+3V3: C001.1 C002.2 C301.1 C302.2 C303.2 C506.2 C507.2 OLED1.2(VCC) P001.6 P001.7 R013.2 R014.2 R101.1 R201.1 R202.1 R203.1 R303.1 U001.1(+VCC) U001.9(VREF) U001.10(IOVDD) U101.9(3V3_2) U301.3(VDDIO) U301.7(VDD) U301.11(NC) U302.2(VDD) U303.5(SD) U304.8(3V3) U305.8(3.3V) U502.5(VS) U502.6(REF2) U503.5(VS) U503.6(REF2)
+5V: P502.1 R102.2 R204.1 R302.1 U003.2(VO+)
AGND: C503.1 C504.2 C505.1 F501.2 U501.6(PGND1) U501.7(PGND2) U501.10(PGND3) U501.12(COMPP) U501.13(COMPN) U501.14(GND) U501.19(nCOMP0) U501.20(GND) U501.21(NC) U501.28(GND) U501.29(EP)
GND: BAT2.3 C001.2 C002.1 C003.2 C005.1 C006.2 C007.1 C301.2 C302.1 C303.1 C506.1 C507.1 D001.2(A) D003.2(A) F501.1 H101.1 H101.2 H102.1 H102.2 H103.1 H103.2 H104.1 H104.2 H105.1 H201.1 OLED1.1(GND) P001.5 P001.16 P001.37 P001.41 P001.42 P002.5 P002.6 P003.2 P502.2 Q001.2(S) R015.2 R018.2 R019.2 R020.2 R021.2 R022.2 R023.2 R024.2 R025.2 R026.2 R027.2 R028.2 R029.2 R030.2 R031.2 R032.2 R033.2 R034.2 R040.1 R301.1 U001.6(GND) U002.2(GND) U003.3(VIN-) U003.4(VO-) U101.5(GND) U101.13(GND1) U101.20(GND2) U101.24(GND3) U101.26(GND4) U101.31(GND5) U101.34(GND6) U101.38(GND7) U201.22(GND) U201.23(GND) U201.24(GND) U201.44(GND) U301.4(NC) U301.8(GNDIO) U301.9(GND) U302.3(GND) U302.4(L/R) U303.4(GAIN) U303.6(GND) U304.1(GND) U305.6(GND) U502.4(GND) U502.7(REF1) U503.4(GND) U503.7(REF1)
V18+: C003.1 C004.2 D001.1(K) P003.1 Q002.2(S) R035.1 R036.1 U002.9(VCC)
VBAT+: BAT1.1 C006.1 C007.2 C502.1 C503.2 C504.1 R016.2 R038.2 R039.2 U002.7(BAT) U003.1(VIN+) U501.4(VM) U501.11(VM)
BLDC_CUR_U: U201.41(GPIO1) U502.8(OUT)
BLDC_CUR_W: U201.40(GPIO2) U503.8(OUT)
BLDC_FOC_EN: U201.35(GPIO38) U501.22(EN3) U501.24(EN2) U501.26(EN1)
BLDC_FOC_IN1: U201.32(GPIO35) U501.27(IN1)
BLDC_FOC_IN2: U201.33(GPIO36) U501.25(IN2)
BLDC_FOC_IN3: U201.34(GPIO37) U501.23(IN3)
BLDC_HALL_A: P502.3 U201.6(GPIO6)
BLDC_HALL_B: P502.4 U201.7(GPIO7)
BLDC_HALL_C: P502.5 U201.13(GPIO3)
ESP32_I2C0_SCL: OLED1.3(SCL) R202.2 U101.3(GPIO3) U201.15(GPIO9) U301.12(SCx)
ESP32_I2C0_SDA: OLED1.4(SDA) R201.2 U101.2(GPIO2) U201.12(GPIO8) U301.2(SDx)
ESP32_I2S_BCLK: U101.35(GPIO18) U201.10(GPIO17) U302.6(SCK) U303.2(BCLK)
ESP32_I2S_DIN: U101.22(GPIO20) U201.26(GPIO20) U302.1(SD)
ESP32_I2S_DOUT: U101.21(GPIO21) U201.25(GPIO19) U303.3(DIN)
ESP32_I2S_LRCLK: U101.18(GPIO19) U201.11(GPIO18) U302.5(WS) U303.1(LRCLK)
ESP32_RESET: R501.1 U201.3(RST) U501.16(nRESET)
ESP32_SPI_CLK: P001.11 U001.16(DCLK) U101.12(GPIO11) U201.19(GPIO13) U304.3(SCK) U305.2(SCK)
ESP32_SPI_MISO: U001.12(DOUT) U101.11(GPIO9) U201.18(GPIO12) U304.4(MISO) U305.4(TX / SCL / MISO)
ESP32_SPI_MOSI: P001.13 U001.14(DIN) U101.10(GPIO10) U201.17(GPIO11) U304.6(MOSI) U305.3(MOSI)
ESP_UART_RXD: H201.3 U201.42(GPIO44)
ESP_UART_TXD: H201.2 U201.43(GPIO43)
LCD_BKC: R017.2 U101.25(GPIO12) U201.30(GPIO45)
LCD_DB0: P001.17 R034.1
LCD_DB1: P001.18 R033.1
LCD_DB2: P001.19 R032.1
LCD_DB3: P001.20 R031.1
LCD_DB4: P001.21 R030.1
LCD_DB5: P001.22 R029.1
LCD_DB6: P001.23 R028.1
LCD_DB7: P001.24 R027.1
LCD_DB8: P001.25 R026.1
LCD_DB9: P001.26 R025.1
LCD_DB10: P001.27 R024.1
LCD_DB11: P001.28 R023.1
LCD_DB12: P001.29 R022.1
LCD_DB13: P001.30 R021.1
LCD_DB14: P001.31 R020.1
LCD_DB15: P001.32 R019.1
LCD_DCX_A0: P001.10 U101.30(GPIO25) U201.27(GPIO21)
LCD_IM0: P001.38 R014.1
LCD_IM2: P001.40 R015.1
LCD_LED_12V+: P001.33 R016.1
LCD_LED_D-: P001.34 P001.35 P001.36 Q001.3(D)
LCD_RESET: P001.15 U101.32(GPIO24) U201.29(GPIO48)
LCD_SPI4W: P001.39 R013.1
LCD_SPI_CS: P001.9 U101.29(GPIO8) U201.20(GPIO14)
MO_U: P501.1 R504.1 U502.3(IN-)
MO_UP: R504.2 U501.5(OUT1) U502.2(IN+)
MO_V: P501.2 U501.8(OUT2)
MO_W: P501.3 R505.1 U503.3(IN-)
MO_WP: R505.2 U501.9(OUT3) U503.2(IN+)
PAN1026_CS: U101.15(GPIO5) U201.36(GPIO39) U304.7(CS)
PAN1026_IRQ: R304.2 U101.16(GPIO6) U201.37(GPIO40)
RASPI_UART_RXD: H105.3 U101.36(GPIO15)
RASPI_UART_TXD: H105.2 U101.37(GPIO14)
RC522_CS: U101.6(GPIO17) U201.9(GPIO16) U305.1(RX / SDA / SS)
RC522_IRQ: U101.7(GPIO27) U201.8(GPIO15) U305.5(IRQ)
RC522_RST: U101.4(GPIO4) U201.16(GPIO10) U305.7(RST)
TSC2046_BUSY: U001.13(BUSY) U101.8(GPIO22) U201.5(GPIO5)
TSC2046_CS: U001.15(CS#) U101.28(GPIO7) U201.28(GPIO47)
TSC2046_IRQ: U001.11(PENIRQ#) U101.33(GPIO23) U201.4(GPIO4)
$1N15018: Q001.1(G) R017.1 R018.1
$1N17217: BAT1.3 BAT2.1
$1N17349: P002.1 U001.2(X+)
$1N17353: P002.2 U001.3(Y+)
$1N17366: P002.3 U001.4(X-)
$1N17371: P002.4 U001.5(Y-)
$1N21361: Q002.1(G) U002.10(DRV)
$1N21734: C004.1 U002.1(VG)
$1N21939: L002.2(A) R036.2
$1N21943: L001.2(A) R035.2
$1N21964: L001.1(K) U002.3(CHRG#)
$1N21969: L002.1(K) U002.4(DONE#)
$1N22003: R037.2 U002.5(COM)
$1N22039: C005.2 R037.1
$1N22127: D002.2(A) Q002.3(D)
$1N22167: D002.1(K) D003.1(K) L003.1
$1N22316: L003.2 R038.1 U002.8(CSP)
$1N22398: R039.1 R040.2 U002.6(FB)
$5N3086: R101.2 U101.1(3V3)
$5N3128: R102.1 U101.39(5V_1) U101.40(5V_2)
$6N2903: R203.2 U201.1(3.3V) U201.2(3.3V)
$6N2944: R204.2 U201.21(5Vin)
$7N439: R301.2 U301.1(SDO)
$7N1503: R302.2 R303.2 U303.7(VDD)
$7N2681: R304.1 U304.5(IRQ)
$8N253: C501.1 U501.2(CP2)
$8N257: C501.2 U501.1(CP1)
$8N263: C502.2 U501.3(VCP)
$8N718: C505.2 R501.2 R502.2 R503.2 U501.15(V3P3OUT)
$8N823: R502.1 U501.17(nSLEEP)
$8N943: L501.2(A) R503.1
$8N961: L501.1(K) U501.18(nFAULT)

Not connected (* = marked no-connect by the designer): BAT1 2*; BAT2 2*; P001 1* 2* 3* 4* 8* 12* 14*; U001 7(VBAT)* 8(AUX)*; U101 14(ID_SD)* 17(GPIO13)* 19(GPIO26)* 23(GPIO16)* 27(ID_SC)*; U201 14(GPIO46)* 31(GPIO0)* 38(GPIO41)* 39(GPIO42)*; U301 5(INT1)* 6(INT2)* 10(CS)*; U304 2(NC)*; U502 1(NC)*; U503 1(NC)*

## Notes on the sheets
sheet 1
- power range: 16~24VDC
- option *
- inductor = 5 * (vin - vbat) (uH)
- LCD_GND
- LCD_RDX
- LCD_TE
- LCD_VCI
- LCD_GND
- LCD_IOVCC
- LCD_YD
- LCD_XR
- LCD_YU
- LCD_XR
sheet 3
- SYS_BOOT

# Board PCB1
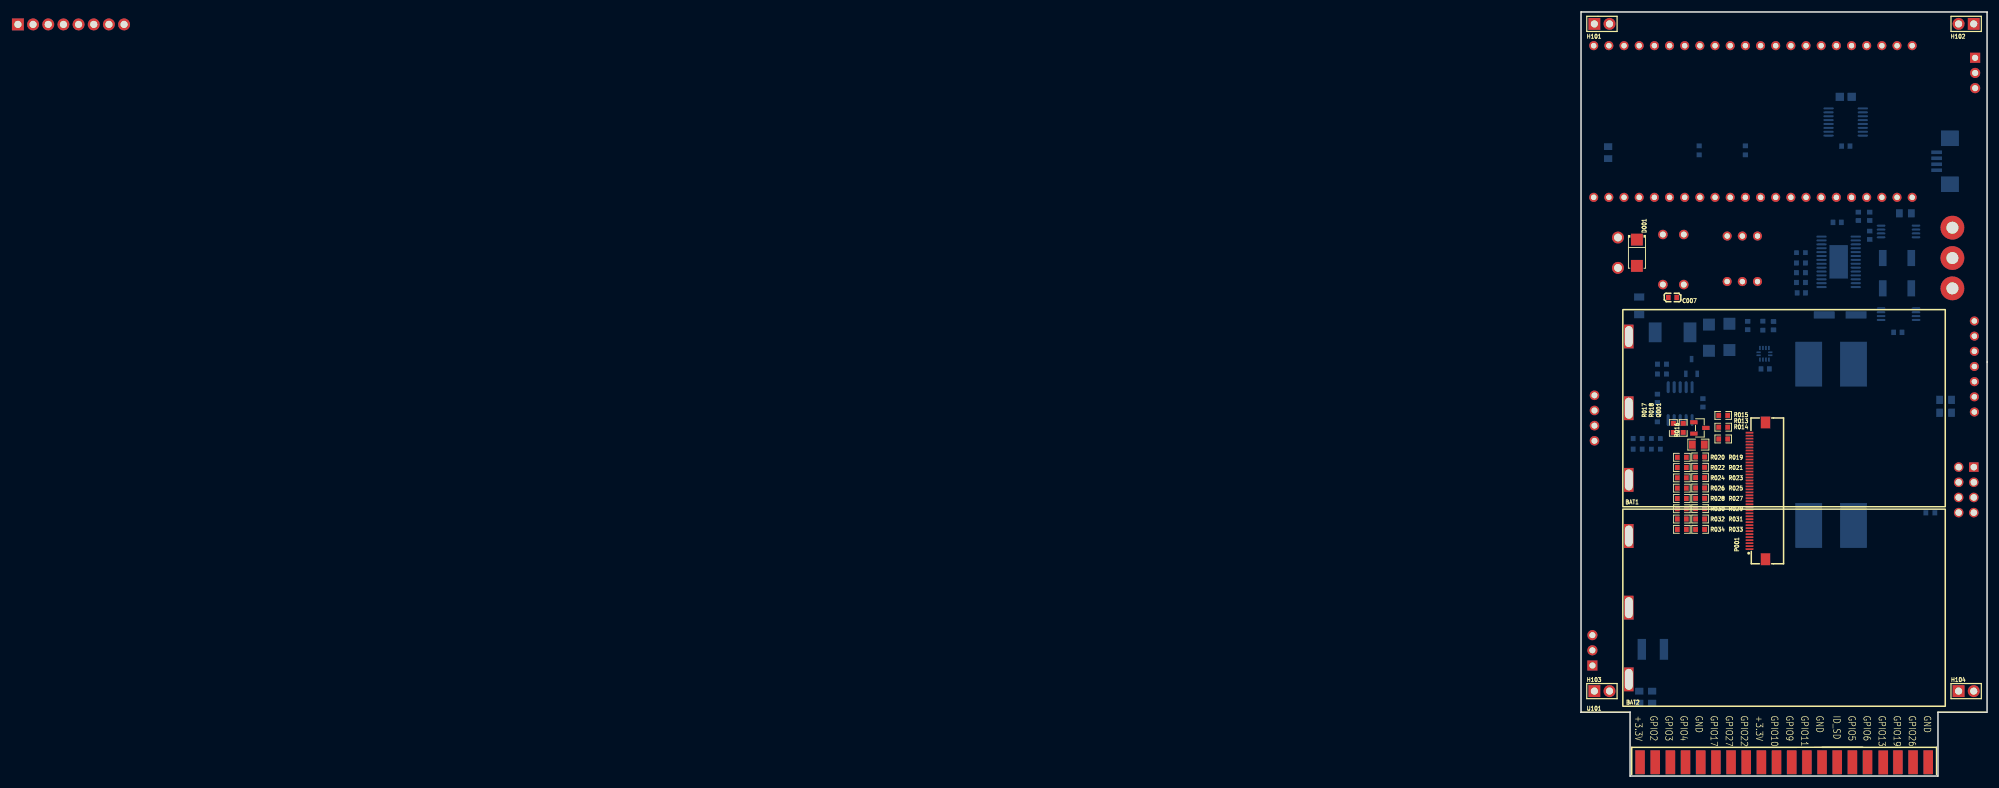
[diagram p5: board, top side]
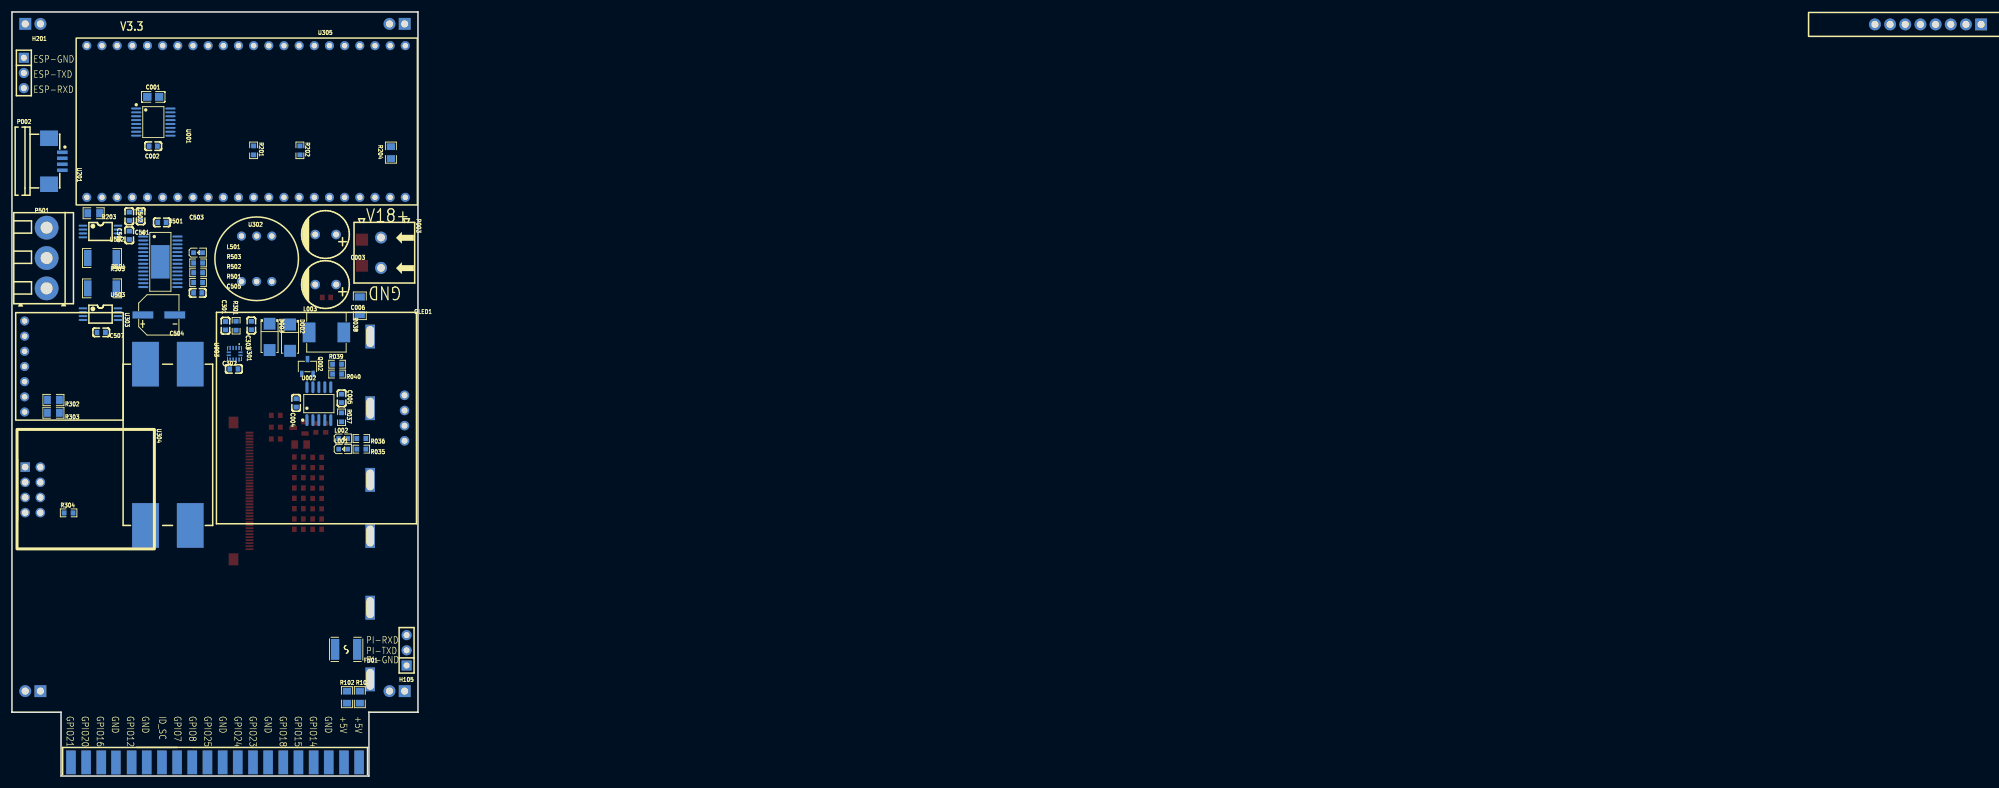
[diagram p6: board, bottom side, seen from below]

Outline 68 x 127.94 mm; copper layers: Top Layer, Bottom Layer. Coordinates in mm from the lower left corner of the outline.
Outline path: 0,10.7 0,127.94 68,127.94 68,10.69 ; 0,10.7 0,10.69 ; 0,10.7 8.22,10.7 8.22,0 59.78,0 59.78,10.7 68,10.7
Stack: Top Layer 0.035mm / Dielectric1 1.51mm FR4 er 4.5 / Bottom Layer 0.035mm

## Design rules (mm)
template: JLCPCB Capability(Two Layers Board)
spacing copperThickness1oz (default): track to track 0.102, other pairs 0.152 to 0.3
spacing copperThickness2oz: track to track 0.203, other pairs 0.152 to 0.3
track width copperThickness1oz (default): min 0.127, default 0.254, max 2.54
track width copperThickness2oz: min 0.203, default 0.254, max 2.54
differential pair differentialPair (default): width min 0.127, default 0.254, max 2.54; gap min 0.152, default 0.152
via viaSize (default): diameter min 0.5, default 0.61, max 10; hole min 0.3, default 0.305, max 6.3

## Placement (name value [footprint] x y rotation side)
BAT1  ZX-XH2.54-3PZZ  [Bat_Lithium_6V4]  7 61.59 90 top
BAT2  ZX-XH2.54-3PZZ  [Bat_Lithium_6V4]  7 28.19 90 top
C001  105  [C0805]  44.33 113.73 180 bottom
C002  100nF  [C0603]  44.33 105.47 180 bottom
C003  470uF  [CAP-TH_BD8.0-P3.50-D0.6-FD_1]  15.46 90.68 0 bottom
C004  100nF  [C0603]  20.41 62.48 90 bottom
C005  220nF  [C0603]  12.79 63.25 270 bottom
C006  10uF  [CAP-TH_BD8.0-P3.50-D0.6-FD_1]  15.46 82.3 0 bottom
C007  100nF  [C0603]  15.33 80.14 180 top
C301  104  [C0603]  32.24 75.41 90 bottom
C302  104  [C0603]  30.84 68.17 0 bottom
C303  104  [C0603]  27.9 75.44 90 bottom
C501  10nF/100V  [C0603]  46.45 93.73 270 bottom
C502  100nF  [C0603]  48.35 93.73 270 bottom
C503  100nF  [C0603]  42.89 92.71 0 bottom
C504  100uF  [CAP-SMD_BD6.3-L6.6-W6.6-LS7.3-FD-H7.7]  43.4 77.22 180 bottom
C505  470nF  [C0603]  36.89 80.91 0 bottom
C506  100nF  [C0603]  48.35 90.55 270 bottom
C507  100nF  [C0603]  53.05 74.29 180 bottom
D001  SS14  [SMA_L4.3-W2.6-LS5.2-RD]  9.36 87.63 270 top
D002  SS24  [SMA_L4.3-W2.6-LS5.2-RD]  21.43 73.41 270 bottom
D003  SS24  [SMA_L4.3-W2.6-LS5.2-RD]  24.86 73.53 270 bottom
F501  SMD1812-050-60  [F1812]  12.03 21.21 0 bottom
H101  PZ254V-11-02P  [HDR-TH_2P-P2.54-V-M]  3.5 125.94 0 top
H102  PZ254V-11-02P  [HDR-TH_2P-P2.54-V-M]  64.5 125.94 180 top
H103  PZ254V-11-02P  [HDR-TH_2P-P2.54-V-M]  3.5 14.22 0 top
H104  PZ254V-11-02P  [HDR-TH_2P-P2.54-V-M]  64.5 14.22 0 top
H105  UART_Terminal  [HDR-TH_3P-P2.54-V-M_PZ254V-11-03P]  1.91 21.06 90 bottom
H201  UART_Terminal  [HDR-TH_3P-P2.54-V-M_PZ254V-11-03P]  66 117.73 270 bottom
L001  red  [LED0603-RD]  12.54 54.74 180 bottom
L002  red  [LED0603-RD]  12.54 56.51 180 bottom
L003  15uH  [IND-SMD_L7.1-W6.6]  15.33 74.29 180 bottom
L501  red  [LED0603-RD]  36.84 87.64 180 bottom
OLED1  HS13L03W2C01  [OLED-TH_L35.4-W33.5_HS13L03W2C01]  2.25 59.94 270 bottom
P001  LCD  [FPC-SMD_AFC01-S40FCA-00]  29.56 47.75 90 top
P002  TS  [FPC-SMD_4P-P1.00_AFA07-S04ECA-00]  60.67 102.94 270 bottom
P003  WJ500V-5.08-2P  [CONN-TH_2P-P5.00_WJ500V-5.08-2P]  6.19 87.63 270 bottom
P501  WJ500V-5.08-03P-14-00A  [CONN-TH_3P-P5.00_WJ500V-5.08-3P]  62.19 86.74 270 bottom
Q001  HL3400  [SOT-23-3_L2.9-W1.3-P1.90-LS2.4-BR]  19.9 58.29 180 top
Q002  AO3407A  [SOT-23-3_L2.9-W1.6-P1.90-LS2.8-BR]  18.51 68.58 270 bottom
R013  10K  [R0603]  23.81 58.42 0 top
R014  10K  [R0603]  23.81 56.44 0 top
R015  10K  [R0603]  23.81 60.39 0 top
R016  1R1  [R0805]  19.65 55.5 180 top
R017  10K  [R0603]  15.46 58.29 270 top
R018  10K  [R0603]  17.11 58.29 270 top
R019  10K  [R0603]  19.94 53.43 180 top
R020  10K  [R0603]  16.89 53.38 180 top
R021  10K  [R0603]  19.94 51.7 180 top
R022  10K  [R0603]  16.89 51.65 180 top
R023  10K  [R0603]  19.94 49.97 180 top
R024  10K  [R0603]  16.89 49.93 180 top
R025  10K  [R0603]  19.94 48.24 180 top
R026  10K  [R0603]  16.89 48.21 180 top
R027  10K  [R0603]  19.94 46.51 180 top
R028  10K  [R0603]  16.89 46.48 180 top
R029  10K  [R0603]  19.94 44.77 180 top
R030  10K  [R0603]  16.89 44.76 180 top
R031  10K  [R0603]  19.94 43.04 180 top
R032  10K  [R0603]  16.89 43.03 180 top
R033  10K  [R0603]  19.94 41.31 180 top
R034  10K  [R0603]  16.89 41.31 180 top
R035  10K  [R0603]  9.49 54.74 0 bottom
R036  10K  [R0603]  9.49 56.51 0 bottom
R037  10K  [R0603]  12.79 60.07 270 bottom
R038  0.125R  [R1206]  9.74 78.74 90 bottom
R039  10K  [R0603]  13.55 68.96 180 bottom
R040  10K  [R0603]  13.55 67.31 0 bottom
R101  4R7  [R0805]  9.74 13.21 270 bottom
R102  4R7  [R0805]  11.9 13.21 90 bottom
R201  4K7  [R0603]  27.52 104.77 270 bottom
R202  4K7  [R0603]  19.78 104.77 270 bottom
R203  4R7  [R0805]  54.32 94.23 0 bottom
R204  4R7  [R0805]  4.54 104.39 270 bottom
R301  10K  [R0603]  30.46 75.41 270 bottom
R302  1R1  [R0805]  61.05 62.99 0 bottom
R303  NC  [R0805]  61.05 60.83 0 bottom
R304  10  [R0603]  58.51 44.07 180 bottom
R501  10K  [R0603]  36.83 82.65 180 bottom
R502  10K  [R0603]  36.83 84.28 180 bottom
R503  1K  [R0603]  36.83 85.92 180 bottom
R504  10mΩ  [R2010]  52.92 86.74 180 bottom
R505  10mΩ  [R2010]  52.92 81.66 180 bottom
U001  TSC2046IPWR  [TSSOP-16_L5.0-W4.4-P0.65-LS6.4-BL]  44.32 109.51 270 bottom
U002  CN3765  [SSOP-10_L4.9-W3.9-P1.00-LS6.0-BL]  16.6 62.36 180 bottom
U003  -  [CX8823_MO]  34.38 68.96 270 bottom
U101  -  [finger_2x20_2.54]  9.85 2.29 0 top
U201  ESP32_S3  [ESP32_S3_N16R8]  55.46 96.9 90 bottom
U301  SC7A20HTR  [LGA-12_L2.0-W2.0-P0.50-TL]  30.71 70.71 270 bottom
U302  INMP441  [INMP441_MODULE]  29.56 82.8 180 bottom
U303  -  [MAX98357_MODULE]  65.88 76.2 270 bottom
U304  -  [PAN1026]  67.15 58.04 270 bottom
U305  -  [RFID_RC522]  34 125.86 0 bottom
U501  MS8313  [HTSSOP-28_L9.7-W4.4-P0.65-LS6.4-BL-EP]  43.14 86.11 270 bottom
U502  INA240A2PWR  [TSSOP-8_L4.4-W3.0-P0.65-LS6.4-BL]  53.18 91.19 270 bottom
U503  INA240A2PWR  [TSSOP-8_L4.4-W3.0-P0.65-LS6.4-BL]  53.18 77.34 270 bottom

## Footprints (pads in the part's own frame, mm; a bottom-side part is the same pattern mirrored in y, then rotated)
Bat_Lithium_6V4
  rect 4x1.6 hole 3.5x1.3: 1(12,-1) 2(0,-1) 3(-12,-1)
C0603
  rect 0.8x0.9 smd: 1(-0.7,0) 2(0.7,0)
C0805
  rect 1.41x1.35 smd: 1(-1,0) 2(1,0)
CAP-SMD_BD6.3-L6.6-W6.6-LS7.3-FD-H7.7
  rect 3.5x1.2 smd: 1(-2.67,0) 2(2.67,0)
CAP-TH_BD8.0-P3.50-D0.6-FD_1
  round 1.6 hole 1: 1(-1.75,0) 2(1.75,0)
CONN-TH_2P-P5.00_WJ500V-5.08-2P
  round 2 hole 1.3: 1(-2.54,0) 2(2.54,0)
CONN-TH_3P-P5.00_WJ500V-5.08-3P
  round 4 hole 2: 1(-5.08,0) 2(0,0) 3(5.08,0)
CX8823_MO
  rect 7.5x4.5 smd: 1(0,-3.75) 2(27,-3.75) 3(0,-11.25) 4(27,-11.25)
ESP32_S3_N16R8
  round 1.524 hole 0.914: 1(0,0) 2(0,-2.54) 3(0,-5.08) 4(0,-7.62) 5(0,-10.16) 6(0,-12.7) 7(0,-15.24) 8(0,-17.78) 9(0,-20.32) 10(0,-22.86) 11(0,-25.4) 12(0,-27.94) 13(0,-30.48) 14(0,-33.02) 15(0,-35.56) 16(0,-38.1) 17(0,-40.64) 18(0,-43.18) 19(0,-45.72) 20(0,-48.26) 21(0,-50.8) 22(0,-53.34) 23(25.4,-53.34) 24(25.4,-50.8) 25(25.4,-48.26) 26(25.4,-45.72) 27(25.4,-43.18) 28(25.4,-40.64) 29(25.4,-38.1) 30(25.4,-35.56) 31(25.4,-33.02) 32(25.4,-30.48) 33(25.4,-27.94) 34(25.4,-25.4) 35(25.4,-22.86) 36(25.4,-20.32) 37(25.4,-17.78) 38(25.4,-15.24) 39(25.4,-12.7) 40(25.4,-10.16) 41(25.4,-7.62) 42(25.4,-5.08) 43(25.4,-2.54) 44(25.4,0)
F1812
  rect 1.407x3.499 smd: 1(-1.853,0) 2(1.853,0)
finger_2x20_2.54
  rect 1.6x4 smd: 1(0.038,0.025) 2(2.579,0.025) 3(5.119,0.025) 4(7.659,0.025) 5(10.198,0.025) 6(12.739,0.025) 7(15.278,0.025) 8(17.819,0.025) 9(20.358,0.025) 10(22.898,0.025) 11(25.439,0.025) 12(27.979,0.025) 13(30.518,0.025) 14(33.059,0.025) 15(35.599,0.025) 16(38.139,0.025) 17(40.767,0) 18(43.218,0.025) 19(45.758,0.025) 20(48.298,0.025)
  rect 1.6x4 smd far side: 21(48.26,0) 22(45.72,0) 23(43.18,0) 24(40.728,-0.025) 25(38.1,0) 26(35.56,0) 27(33.02,0) 28(30.48,0) 29(27.94,0) 30(25.4,0) 31(22.86,0) 32(20.32,0) 33(17.78,0) 34(15.24,0) 35(12.7,0) 36(10.16,0) 37(7.62,0) 38(5.08,0) 39(2.54,0) 40(0,0)
FPC-SMD_4P-P1.00_AFA07-S04ECA-00
  rect 0.6x1.8 smd: 1(-1.5,1.115) 2(-0.5,1.115) 3(0.5,1.115) 4(1.5,1.115)
  rect 2.6x3 smd: 5(3.85,-1.115) 6(-3.85,-1.115)
FPC-SMD_AFC01-S40FCA-00
  rect 0.3x1.3 smd: 1(-9.75,1.34) 2(-9.25,1.339) 3(-8.75,1.34) 4(-8.25,1.34) 5(-7.75,1.34) 6(-7.25,1.34) 7(-6.75,1.34) 8(-6.25,1.34) 9(-5.75,1.34) 10(-5.25,1.34) 11(-4.75,1.34) 12(-4.25,1.34) 13(-3.75,1.34) 14(-3.25,1.34) 15(-2.75,1.34) 16(-2.25,1.34) 17(-1.75,1.34) 18(-1.25,1.34) 19(-0.75,1.34) 20(-0.25,1.34) 21(0.25,1.34) 22(0.75,1.34) 23(1.25,1.34) 24(1.75,1.34) 25(2.25,1.34) 26(2.75,1.34) 27(3.25,1.34) 28(3.75,1.34) 29(4.25,1.34) 30(4.75,1.34) 31(5.25,1.34) 32(5.75,1.34) 33(6.25,1.34) 34(6.75,1.34) 35(7.25,1.34) 36(7.75,1.34) 37(8.25,1.34) 38(8.75,1.34) 39(9.25,1.34) 40(9.75,1.34)
  rect 2x1.6 smd: 41(-11.45,-1.34) 42(11.45,-1.34)
HDR-TH_2P-P2.54-V-M
  rect 2x2 hole 1.2: 1(-1.27,0)
  round 2 hole 1.2: 2(1.27,0)
HDR-TH_3P-P2.54-V-M_PZ254V-11-03P
  rect 1.7x1.7 hole 1.02: 1(-2.54,0)
  round 1.7 hole 1.02: 2(0,0) 3(2.54,0)
HTSSOP-28_L9.7-W4.4-P0.65-LS6.4-BL-EP
  oval 0.343x1.732 smd: 1(-4.225,-2.866) 2(-3.575,-2.866) 3(-2.925,-2.866) 4(-2.275,-2.866) 5(-1.625,-2.866) 6(-0.975,-2.866) 7(-0.325,-2.866) 8(0.325,-2.866) 9(0.975,-2.866) 10(1.625,-2.866) 11(2.275,-2.866) 12(2.925,-2.866) 13(3.575,-2.866) 14(4.225,-2.866) 15(4.225,2.866) 16(3.575,2.866) 17(2.925,2.866) 18(2.275,2.866) 19(1.625,2.866) 20(0.975,2.866) 21(0.325,2.866) 22(-0.325,2.866) 23(-0.975,2.866) 24(-1.625,2.866) 25(-2.275,2.866) 26(-2.925,2.866) 27(-3.575,2.866) 28(-4.225,2.866)
  rect 5.6x3.1 smd: 29(0,0)
IND-SMD_L7.1-W6.6
  rect 2.15x3.32 smd: 1(-2.913,0) 2(2.913,0)
INMP441_MODULE
  round 1.524 hole 0.914: 1(0,0) 2(2.54,0) 3(5.08,0) 4(5.08,7.62) 5(2.54,7.62) 6(0,7.62)
LED0603-RD
  rect 0.8x0.8 smd: 1(-0.749,0) 2(0.749,0)
LGA-12_L2.0-W2.0-P0.50-TL
  rect 0.7x0.28 smd: 1(-0.975,0.75) 2(-0.975,0.25) 3(-0.975,-0.25) 4(-0.975,-0.75) 7(0.975,-0.75) 8(0.975,-0.25) 9(0.975,0.25) 10(0.975,0.75)
  rect 0.28x0.7 smd: 5(-0.25,-0.975) 6(0.25,-0.975) 11(0.25,0.975) 12(-0.25,0.975)
MAX98357_MODULE
  round 1.524 hole 0.914: 1(0,0) 2(2.54,0) 3(5.08,0) 4(7.62,0) 5(10.16,0) 6(12.7,0) 7(15.24,0)
OLED-TH_L35.4-W33.5_HS13L03W2C01
  round 1.6 hole 1: 1(-3.81,0) 2(-1.27,0) 3(1.27,0) 4(3.81,0)
PAN1026
  rect 1.6x1.6 hole 1.1: 1(6.309,1.361)
  round 1.6 hole 1.1: 2(8.849,1.361) 3(11.389,1.361) 4(13.929,1.361) 5(13.929,3.901) 6(11.389,3.901) 7(8.849,3.901) 8(6.309,3.901)
R0603
  rect 0.806x0.864 smd: 1(-0.753,0) 2(0.753,0)
R0805
  rect 1.133x1.377 smd: 1(-1,0) 2(1,0)
R1206
  rect 1.208x1.701 smd: 1(-1.479,0) 2(1.479,0)
R2010
  rect 1.282x2.7 smd: 1(-2.391,0) 2(2.391,0)
RFID_RC522
  rect 2x2 hole 1.2: 1(-295.783,0)
  round 2 hole 1.2: 2(-293.243,0) 3(-290.703,0) 4(-288.163,0) 5(-285.623,0) 6(-283.083,0) 7(-280.543,0) 8(-278.003,0)
SMA_L4.3-W2.6-LS5.2-RD
  rect 2x2 smd: 1(-2.2,0) 2(2.2,0)
SOT-23-3_L2.9-W1.3-P1.90-LS2.4-BR
  rect 1.25x0.7 smd: 1(1,-0.95) 2(1,0.95) 3(-1,0)
SOT-23-3_L2.9-W1.6-P1.90-LS2.8-BR
  rect 1.07x0.6 smd: 1(1.235,-0.95) 2(1.235,0.95) 3(-1.235,0)
SSOP-10_L4.9-W3.9-P1.00-LS6.0-BL
  oval 0.525x2.014 smd: 1(-2,-2.756) 2(-1,-2.756) 3(0,-2.756) 4(1,-2.756) 5(2,-2.756) 6(2,2.756) 7(1,2.756) 8(0,2.756) 9(-1,2.756) 10(-2,2.756)
TSSOP-8_L4.4-W3.0-P0.65-LS6.4-BL
  oval 0.353x1.454 smd: 1(-0.975,-2.927) 2(-0.325,-2.927) 3(0.325,-2.927) 4(0.975,-2.927) 5(0.975,2.927) 6(0.325,2.927) 7(-0.325,2.927) 8(-0.975,2.927)
TSSOP-16_L5.0-W4.4-P0.65-LS6.4-BL
  oval 0.343x1.732 smd: 1(-2.275,-2.866) 2(-1.625,-2.866) 3(-0.975,-2.866) 4(-0.325,-2.866) 5(0.325,-2.866) 6(0.975,-2.866) 7(1.625,-2.866) 8(2.275,-2.866) 9(2.275,2.866) 10(1.625,2.866) 11(0.975,2.866) 12(0.325,2.866) 13(-0.325,2.866) 14(-0.975,2.866) 15(-1.625,2.866) 16(-2.275,2.866)

## Nets
As in the schematic.

Pads without a net: BAT1 2; BAT2 2; P001 1 2 3 4 8 12 14; U001 7 8; U101 14 17 19 23 27; U201 6 7 13 14 31 38 39; U301 5 6 10; U304 2; U502 1; U503 1

## Text on the board
Bottom Silkscreen Layer: PI-RXD | PI-TXD | PI-GND | ESP-GND | ESP-TXD | ESP-RXD | +5V | GND | GPIO14 | GPIO15 | GPIO18 | GPIO23 | GPIO24 | GPIO25 | GPIO8 | GPIO7 | ID_SC | GPIO12 | GPIO16 | GPIO20 | GPIO21 | V3.3 | V18+
Top Silkscreen Layer: +3.3V | GPIO2 | GPIO3 | GPIO4 | GND | GPIO17 | GPIO27 | GPIO22 | GPIO10 | GPIO9 | GPIO11 | ID_SD | GPIO5 | GPIO6 | GPIO13 | GPIO19 | GPIO26
